# Altium project piggyback.PrjPcb
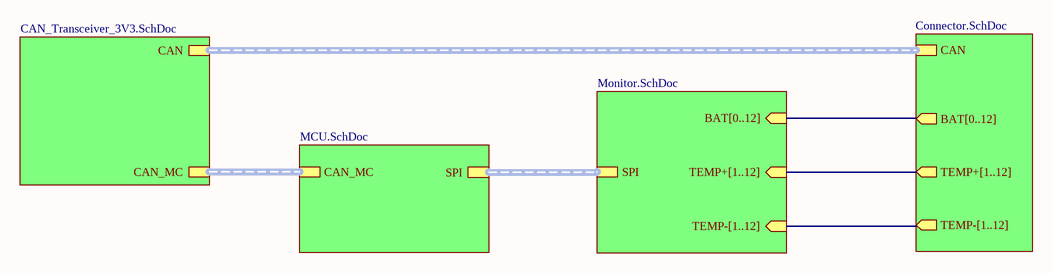
[diagram p0: Main.SchDoc]
11 sheets, 315 parts. Net scope: hierarchical (ports join the sheet entries above them; power ports are global).
Board file: template_4.PcbDoc
Sheets:
  Main.SchDoc
    S2 = MCU.SchDoc
     = CAN_Transceiver_3V3.SchDoc
    S4 = Monitor.SchDoc
      S5 = Input_Fuses.SchDoc
      S6 = LTC_6811-1.SchDoc
      S7 = Mux.SchDoc
      U_passive_balancing = passive_balancing.SchDoc
      U_primary_decoupling = decoupling.SchDoc
      TEMP1 = subtractor_single.SchDoc
      TEMP2 = subtractor_single.SchDoc
      TEMP3 = subtractor_single.SchDoc
      TEMP4 = subtractor_single.SchDoc
      TEMP5 = subtractor_single.SchDoc
      TEMP6 = subtractor_single.SchDoc
      TEMP7 = subtractor_single.SchDoc
      TEMP8 = subtractor_single.SchDoc
      TEMP9 = subtractor_single.SchDoc
      TEMP10 = subtractor_single.SchDoc
      TEMP11 = subtractor_single.SchDoc
      TEMP12 = subtractor_single.SchDoc
    S9 = Connector.SchDoc

## Sheet Main.SchDoc
size 250 x 119 mm; DocumentNumber: 6; SheetNumber: 6; SheetTotal: 11

### Sub-sheets
S2 = MCU.SchDoc: CAN_MC (harness CAN_MC), SPI (harness SPI)
S4 = Monitor.SchDoc: BAT[0..12] (in), TEMP+[1..12] (in), SPI (harness SPI), TEMP-[1..12] (in)
S9 = Connector.SchDoc: BAT[0..12] (out), TEMP+[1..12] (out), CAN (harness CAN), TEMP-[1..12] (out)
? = CAN_Transceiver_3V3.SchDoc: CAN_MC (harness CAN_MC), CAN (harness CAN)

### Buses and harness runs
bus sheet S4/BAT[0..12] = sheet S9/BAT[0..12]
bus sheet S4/TEMP+[1..12] = sheet S9/TEMP+[1..12]
bus sheet S4/TEMP-[1..12] = sheet S9/TEMP-[1..12]
harness sheet /CAN = sheet S9/CAN
harness sheet /CAN_MC = sheet S2/CAN_MC
harness sheet S2/SPI = sheet S4/SPI

## Sheet MCU.SchDoc
size 250 x 149 mm; DocumentNumber: 1; SheetNumber: 1; SheetTotal: 11
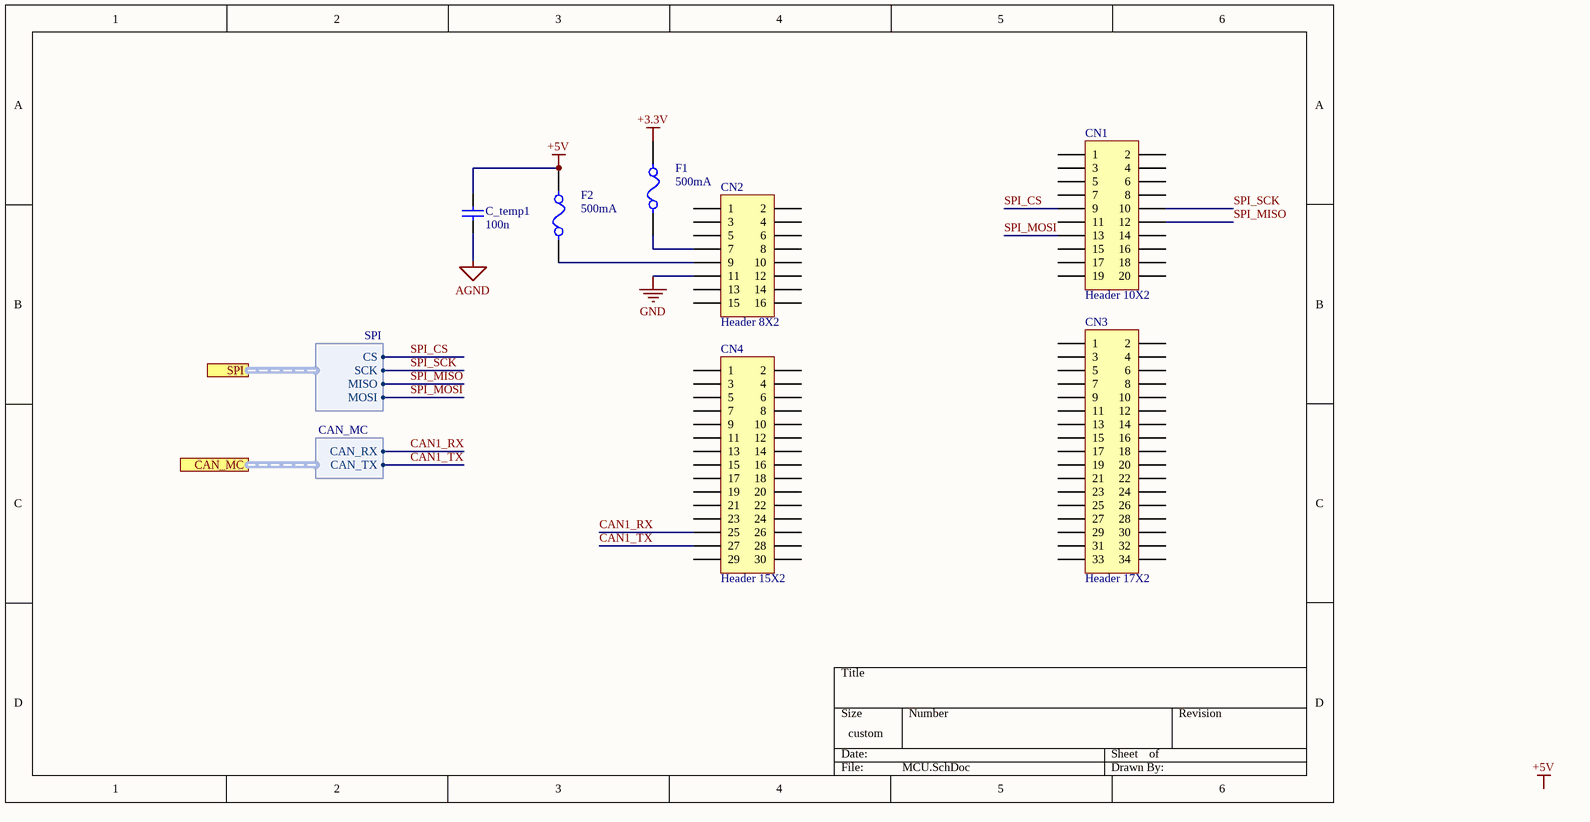
[diagram p1: MCU.SchDoc]

### Parts
C_temp1  100n  [CAPC0603(1608)55_N]
CN1  Header 10X2  [HDR2X10]
CN2  Header 8X2  [HDR2X8]
CN3  Header 17X2  [HDR2X17]
CN4  Header 15X2  [HDR2X15]
F1  500mA  [Fuse_500_mA]
F2  500mA  [Fuse_500_mA]

### Ports
CAN_MC (harness CAN_MC), SPI (harness SPI)

### Harnesses
SPI: CS, SCK, MISO, MOSI
CAN_MC: CAN_RX, CAN_TX

### Nets
+3.3V: F1.2
+5V: C_temp1.1 F2.2
AGND: C_temp1.2
GND: CN2.11
CAN1_RX: CN4.25 ; port CAN_MC.CAN_RX
CAN1_TX: CN4.27 ; port CAN_MC.CAN_TX
SPI_CS: CN1.9 ; port SPI.CS  [project net CS]
SPI_MISO: CN1.12 ; port SPI.MISO  [project net MISO]
SPI_MOSI: CN1.13 ; port SPI.MOSI  [project net MOSI]
SPI_SCK: CN1.10 ; port SPI.SCK  [project net SCK]
NetCN2_7: CN2.7 F1.1
NetCN2_9: CN2.9 F2.1

Not connected (* = marked no-connect by the designer): CN1 1 2 3 4 5 6 7 8 11 14 15 16 17 18 19 20; CN2 1 2 3 4 5 6 8 10 12 13 14 15 16; CN3 1 2 3 4 5 6 7 8 9 10 11 12 13 14 15 16 17 18 19 20 21 22 23 24 25 26 27 28 29 30 31 32 33 34; CN4 1 2 3 4 5 6 7 8 9 10 11 12 13 14 15 16 17 18 19 20 21 22 23 24 26 28 29 30

### Notes on the sheet
- Labels drawn without touching a wire or pin: +5V

### Library data of the parts
C_temp1 = Cap 100n: Keramikvielschichtkondensator, SMD, Baureihe MC, ± 10%; Manufacturer: TDK; Voltage Rating: 50V; OC_MOUSER: CGA3E2X7R1H104K080AA; Value: 100n; PackageReference: 0603; Tolerance: ± 10%
CN1 = Header 10X2: Header, 10-Pin, Dual row; LatestRevisionDate: 17-Jul-2002; LatestRevisionNote: Re-released for DXP Platform.; Publisher: Altium Limited
CN2 = Header 8X2: Header, 8-Pin, Dual row; LatestRevisionDate: 17-Jul-2002; LatestRevisionNote: Re-released for DXP Platform.; Publisher: Altium Limited
CN3 = Header 17X2: Header, 17-Pin, Dual row; LatestRevisionDate: 17-Jul-2002; LatestRevisionNote: Re-released for DXP Platform.; Publisher: Altium Limited
CN4 = Header 15X2: Header, 15-Pin, Dual row; LatestRevisionDate: 17-Jul-2002; LatestRevisionNote: Re-released for DXP Platform.; Publisher: Altium Limited
F1 F2 = Fuse_500mA: 0679H0500-01, Sicherungen zur Aufbaumontage 500mA 350 VAC 72 VCD; Voltage_Rating: 72 VDC; Value: 500mA; OC_Mouser: 530-0679H0500-01

## Sheet CAN_Transceiver_3V3.SchDoc
size A4; DocumentNumber: 2; SheetNumber: 2; SheetTotal: 11
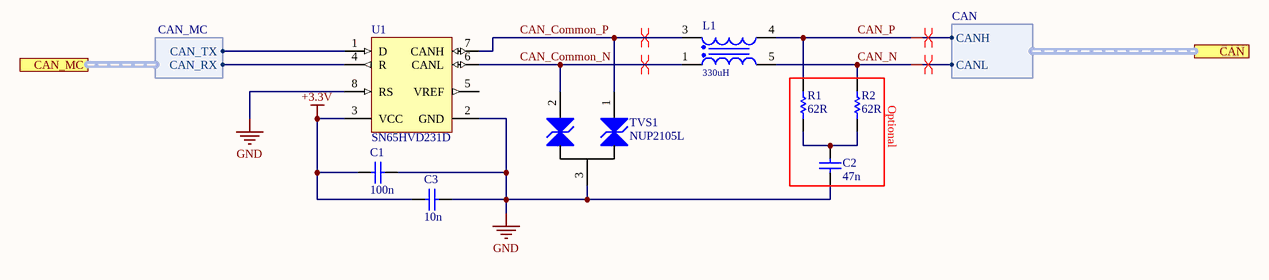
[diagram p2: CAN_Transceiver_3V3.SchDoc]

### Parts
C1  100n  [CAPC0603(1608)55_N]
C2  47n  [CAPC0603(1608)55_N]
C3  10n  [CAPC0603(1608)55_N]
L1  330uH  [WE-SL1]
R1  62R  [RESC0603(1608)_N]
R2  62R  [RESC0603(1608)_N]
TVS1  NUP2105L  [_SOT23-3N]
U1  SN65HVD231D  [D0008A_L]

### Ports
CAN (harness CAN), CAN_MC (harness CAN_MC)

### Harnesses
CAN_MC: CAN_RX, CAN_TX
CAN: CANH, CANL

### Nets
+3.3V: C1.1 C3.1 U1.3(VCC)
GND: C1.2 C2.1 C3.2 TVS1.3(A3) U1.2(GND) U1.8(RS)
CAN1_RX: U1.4(R) ; port CAN_MC.CAN_RX
CAN1_TX: U1.1(D) ; port CAN_MC.CAN_TX
CAN_Common_N: L1.1 TVS1.2(A2) U1.6(CANL)
CAN_Common_P: L1.3 TVS1.1(A1) U1.7(CANH)
CAN_N: L1.5 R2.2 ; port CAN.CANL
CAN_P: L1.4 R1.2 ; port CAN.CANH
NetC2_2: C2.2 R1.1 R2.1

Not connected (* = marked no-connect by the designer): U1 5(VREF)

### Layout directives
differential pair: CAN_Common_N, CAN_Common_P, CAN_N, CAN_P

### Notes on the sheet
- (near R2) Optional

### Library data of the parts
C1 = Cap 100n: as C_temp1 on sheet MCU; OC_MOUSER: CGA3E2X7R1H104K080AA; Value: 100n; PackageReference: 0603; Tolerance: ± 10%
C2 = Cap 47n: Keramikvielschichtkondensator, SMD, Baureihe MC, ± 10%; Manufacturer: TDK; Voltage Rating: 50V; OC_MOUSER: CGA3E2X7R1H473K080AA; Value: 47n; PackageReference: 0603; Tolerance: ± 10%
C3 = Cap 10n: Keramikvielschichtkondensator, SMD, Baureihe MC, ± 10%; Manufacturer: TDK; Voltage Rating: 50V; OC_MOUSER: CGA3E2X7R1H103K080AA; Value: 10n; PackageReference: 0603; Tolerance: ± 10%
L1 = 744212331: WE-SL1 SMT Common Mode Line Filter, 330uH, 300mA, 80V; Manufacturer: Wurth Elektronik; Impedance max.: 2000Ohm; Insulation Test Voltage: 250VAC; Winding Style: sectional; ComponentLink1Description: Manufacturer; ComponentLink1URL: http://www.we-online.de; ComponentLink2Description: Datasheet; ComponentLink2URL: https://www.we-online.com/catalog/datasheet/744212331.pdf; Published Date: April 2020; Rated Current: 300mA; Rated Voltage: 80V; Inductance: 330uH; Operating Temperature: -40 to +105degC; Mounting Technology: SMT; Packaging: Tape and Reel; Manufacturer Part Number: 744212331
R1 R2 = Res 62R: Chipwiderstand, SMD, Baureihe MC, 1%; Manufacturer: Multicomp; Power: 100mW; PackageReference: 0603; Value: 62R; OC_FARNELL: 9331433
TVS1 = NUP2105L: Dual Bidirectional Voltage Suppressor 350W Peak
U1 = CMP-0315-00079-2: 3.3V CAN Transceiver with Sleep Mode, 17 mA, 3.3 V, -40 to 85 degC, 8-pin SOIC (D), Green (RoHS & no Sb/Br); Manufacturer: Texas Instruments; Drivers Per Package: 1; Rating: Catalog; Transient Pulse Protection(V): -25 to 25; Supply Voltage(s)(V): 3.3; ICC(Max)(mA): 17; Features: Bus Wake Up; Footprint: PCA82C250; ComponentLink1URL: http://www.ti.com/general/docs/lit/getliterature.tsp?genericPartNumber=SN65HVD231&fileType=pdf; PackageVersion: revM, Jun-2011; SubFamily: CAN; PartNumber: SN65HVD231D; DatasheetVersion: SLOS346K; Isolated: No; PackageDescription: 8-Pin Plastic Small Outline Integrated Circuit, 4.9 x 3.9 mm, Pitch 1.27 mm Pitch; Low Power Mode: Sleep; Code_JEDEC: MS-012AA; ComponentLink1Description: Datasheet; PackageReference: D0008A; Eco-Plan: Green (RoHS & no Sb/Br); Mounting Technology: Surface Mount; Receivers Per Package: 1

## Sheet Monitor.SchDoc
size 299 x 149 mm; DocumentNumber: 8; SheetNumber: 8; SheetTotal: 11
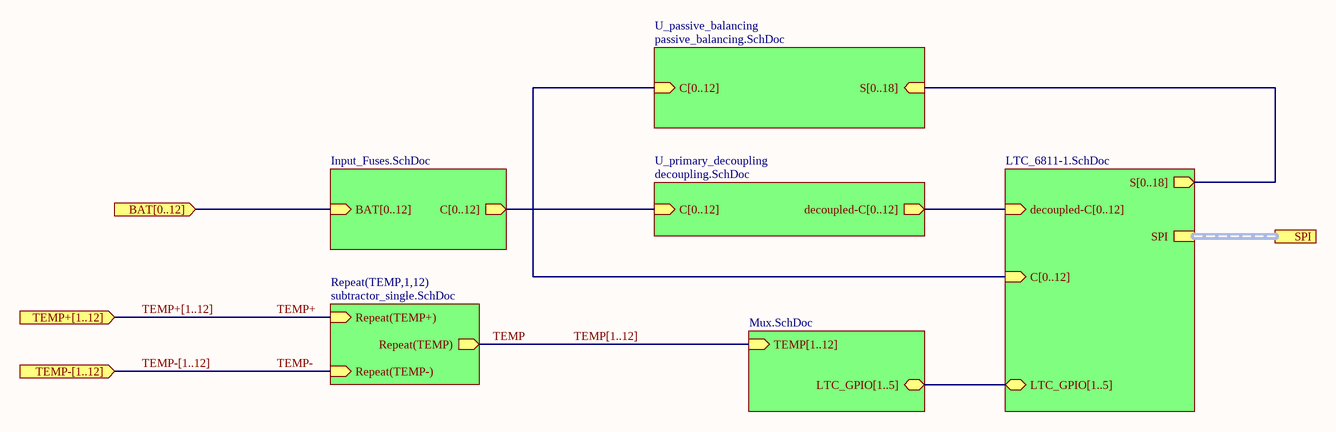
[diagram p3: Monitor.SchDoc]

### Sub-sheets
Repeat(TEMP,1,12) = subtractor_single.SchDoc: Repeat(TEMP+) (in), Repeat(TEMP) (out), Repeat(TEMP-) (in)
S5 = Input_Fuses.SchDoc: BAT[0..12] (in), C[0..12] (out)
S6 = LTC_6811-1.SchDoc: LTC_GPIO[1..5] (bidir), SPI (harness SPI), S[0..18] (out), decoupled-C[0..12] (in), C[0..12] (in)
S7 = Mux.SchDoc: TEMP[1..12] (in), LTC_GPIO[1..5] (bidir)
U_passive_balancing = passive_balancing.SchDoc: S[0..18] (in), C[0..12] (in)
U_primary_decoupling = decoupling.SchDoc: C[0..12] (in), decoupled-C[0..12] (out)

### Ports
BAT[0..12] (in), SPI (harness SPI), TEMP+[1..12] (in), TEMP-[1..12] (in)

### Nets
TEMP: sheet Repeat(TEMP,1,12)/Repeat(TEMP)
TEMP+: sheet Repeat(TEMP,1,12)/Repeat(TEMP+)
TEMP-: sheet Repeat(TEMP,1,12)/Repeat(TEMP-)

### Buses and harness runs
bus port BAT[0..12] = sheet S5/BAT[0..12]
bus sheet S5/C[0..12] = sheet S6/C[0..12] = sheet U_passive_balancing/C[0..12] = sheet U_primary_decoupling/C[0..12]
bus sheet S6/decoupled-C[0..12] = sheet U_primary_decoupling/decoupled-C[0..12]
bus sheet S6/LTC_GPIO[1..5] = sheet S7/LTC_GPIO[1..5]
bus sheet S6/S[0..18] = sheet U_passive_balancing/S[0..18]
bus TEMP+[1..12] = port TEMP+[1..12]
bus TEMP-[1..12] = port TEMP-[1..12]
bus TEMP[1..12] = sheet S7/TEMP[1..12]
harness port SPI = sheet S6/SPI

## Sheet Input_Fuses.SchDoc
size 199 x 250 mm; DocumentNumber: 4; SheetNumber: 4; SheetTotal: 11
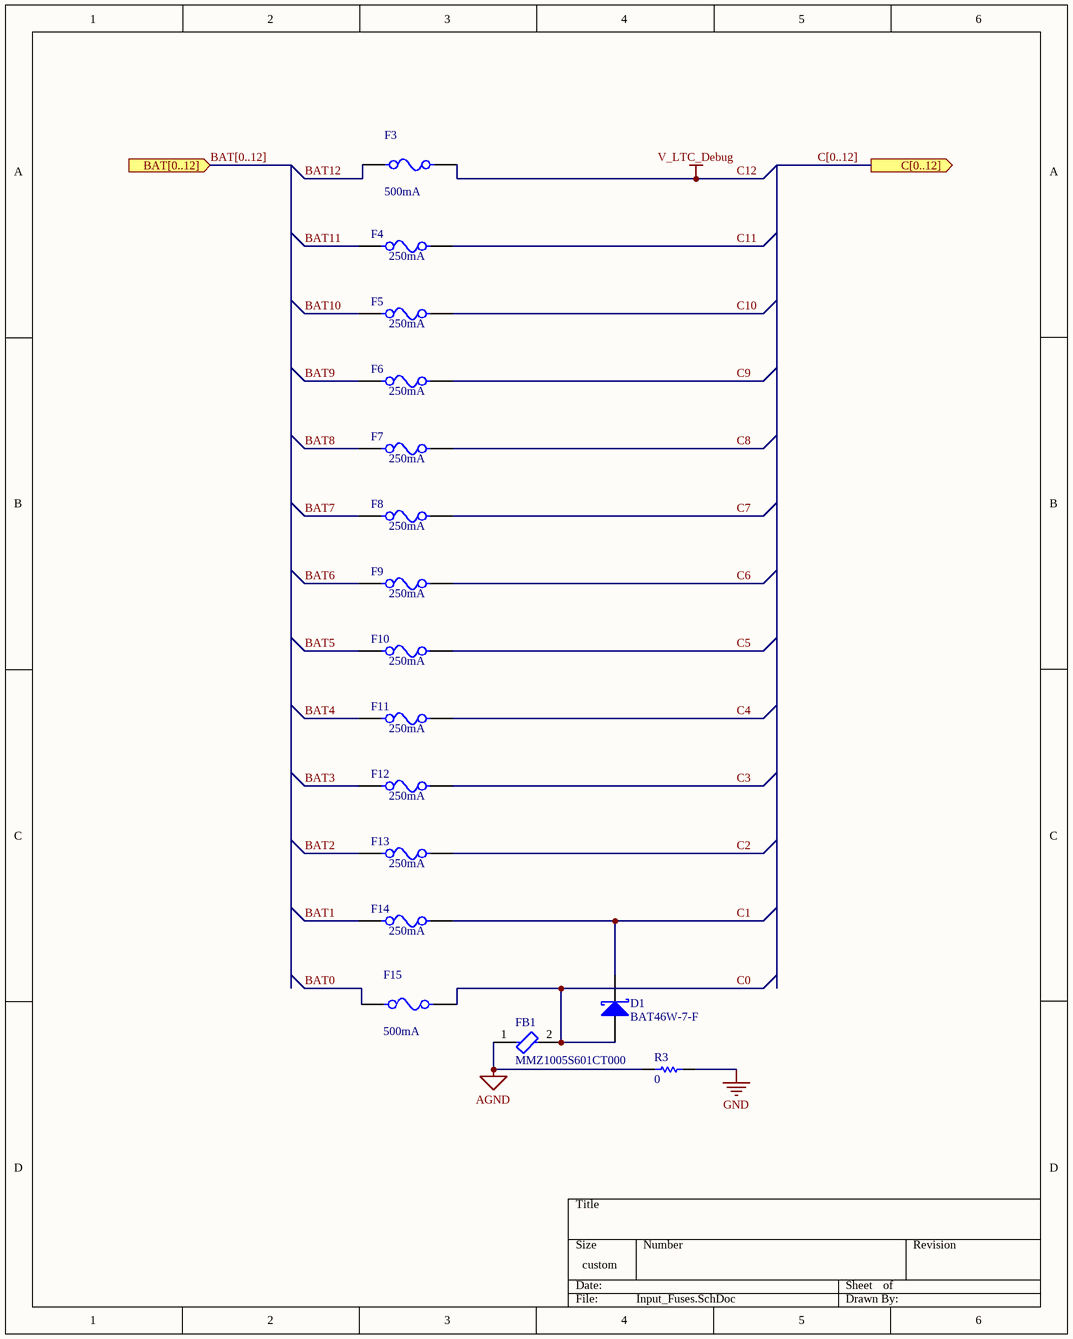
[diagram p4: Input_Fuses.SchDoc]

### Parts
D1  BAT46W-7-F  [DIOD-SOD-123-2_V]
F3  500mA  [Fuse_500_mA]
F4  250mA  [RESC0603(1608)_N]
F5  250mA  [RESC0603(1608)_N]
F6  250mA  [RESC0603(1608)_N]
F7  250mA  [RESC0603(1608)_N]
F8  250mA  [RESC0603(1608)_N]
F9  250mA  [RESC0603(1608)_N]
F10  250mA  [RESC0603(1608)_N]
F11  250mA  [RESC0603(1608)_N]
F12  250mA  [RESC0603(1608)_N]
F13  250mA  [RESC0603(1608)_N]
F14  250mA  [RESC0603(1608)_N]
F15  500mA  [Fuse_500_mA]
FB1  MMZ1005S601CT000  [FP-MMZ1005-MFG]
R3  0  [RESC0603(1608)_N]

### Ports
BAT[0..12] (in), C[0..12] (out)

### Nets
AGND: FB1.1 R3.2
C12: F3.1  [also labelled V_LTC_Debug]
GND: R3.1
BAT0: F15.2
BAT1: F14.1
BAT2: F13.1
BAT3: F12.1
BAT4: F11.1
BAT5: F10.1
BAT6: F9.1
BAT7: F8.1
BAT8: F7.1
BAT9: F6.1
BAT10: F5.1
BAT11: F4.1
BAT12: F3.2
C0: D1.1(A) F15.1 FB1.2
C1: D1.2(K) F14.2
C2: F13.2
C3: F12.2
C4: F11.2
C5: F10.2
C6: F9.2
C7: F8.2
C8: F7.2
C9: F6.2
C10: F5.2
C11: F4.2

### Buses and harness runs
bus BAT[0..12] = port BAT[0..12]
bus C[0..12] = port C[0..12]

### Library data of the parts
D1 = CMP-0303-00004-1: Surface Mount Schottky Barrier Diode, 100 V, -55 to 125 degC, 2-Pin SOD123, RoHS, Tape and Reel; Manufacturer: Diodes Inc; IR@1.5 V: 0.3 uA Max.; V(BR)R: 100 V Min.; VF@10 mA: 0.45 V Max.; CT@1 V: 12 pF Typ.; PartNumber: BAT46W-7-F; ComponentLink1URL: http://www.diodes.com/; ComponentLink3URL: http://diodes.com/datasheets/ds30044.pdf; PackageDescription: 2-Pin SMD, Body 2.7 x 1.55 mm, Height 1.45 mm; ComponentLink2Description: Datasheet; ComponentLink3Description: Package Specification; Mounting Technology: Surface Mount; ComponentLink1Description: Manufacturer URL; RoHS: TRUE; Operating Temperature: -55 to 125 degC; Packing: Tape and Reel; ComponentLink2URL: http://diodes.com/datasheets/ds30044.pdf; DatasheetVersion: Rev. 16-2
F3 F15 = Fuse_500mA: as F1 on sheet MCU; Value: 500mA; OC_Mouser: 530-0679H0500-01
F4-F14 = Bel Fuse C2Q250: Fuse, Fast Blow 250mA, 63VDC; Voltage Rating AC: 32V; Voltage Rating DC: 63; OC_Mouser: 530-C2Q250; Value: 250mA; PackageReference: 0603; Manufacturer: Bel Fuse; Characteristic: Fast Blow
FB1 = CMP-08257-000098-1: Signal Line Ferrite Bead 600Ω @ 100MHz 300mA DCR 520mΩ SMD 0402; Tolerance: 25%; Impedance: 600R; DC Resistance (DCR): 600mR; Height: 0.022inch; Series: MMZ; Case Code (Metric): 1005; Case Code (Imperial): 0402; Length: 0.039inch; RoHS Compliant: Yes; Package Quantity: 10000; Case/Package: 0402; Packaging: Cut Tape; Current Rating: 300mA; Max DC Current: 300mA; Width: 0.02inch; Core Material: Ferrite; Lead Free: Lead Free; REACH SVHC: No SVHC; Mount: Surface Mount
R3 = Res 0R: Chipwiderstand, SMD, Baureihe MC, 1%; Manufacturer: Multicomp; Value: 0R; Power: 100mW; PackageReference: 0603; OC_FARNELL: 9331662

## Sheet LTC_6811-1.SchDoc
size 299 x 299 mm; DocumentNumber: 5; SheetNumber: 5; SheetTotal: 11
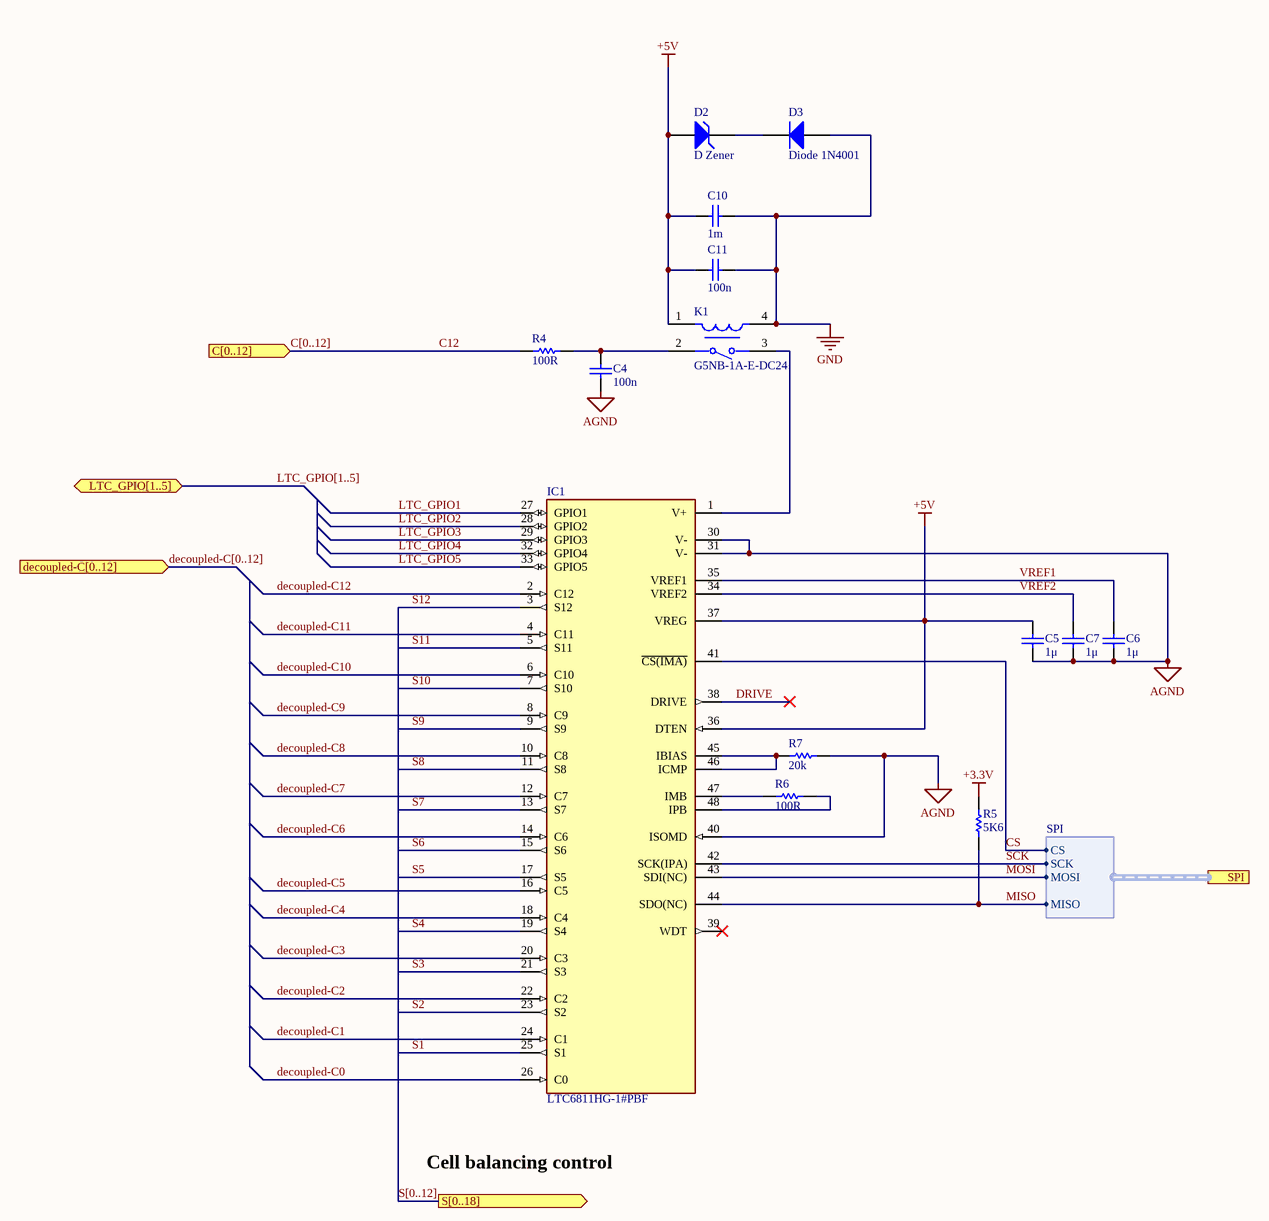
[diagram p5: LTC_6811-1.SchDoc]

### Parts
C4  100n  [CAPC0603(1608)55_N]
C5  1μ  [CAPC0603(1608)55_N]
C6  1μ  [CAPC0603(1608)55_N]
C7  1μ  [CAPC0603(1608)55_N]
C10  1m  [CAPC0603(1608)55_N]
C11  100n  [CAPC0603(1608)55_N]
D2  D Zener  [DIODE-0.7]
D3  Diode 1N4001  [DO-41]
IC1  LTC6811HG-1#PBF  [FP-G-48-05-08-1887-MFG]
K1  G5NB-1A-E-DC24  [FP-G5NB-1A-E-DC24-MFG]
R4  100R  [RESC0603(1608)_N]
R5  5K6  [RESC0603(1608)_N]
R6  100R  [RESC0603(1608)_N]
R7  20k  [RESC0603(1608)_N]

### Ports
C[0..12] (in), decoupled-C[0..12] (in), LTC_GPIO[1..5] (bidir), S[0..18] (out), SPI (harness SPI)

### Harnesses
SPI: SCK, MOSI, MISO, CS

### Nets
+3.3V: R5.2
+5V: C5.2 C10.1 C11.1 D2.1(A) IC1.36(DTEN) IC1.37(VREG) K1.1
AGND: C4.1 C5.1 C6.1 C7.1 IC1.30(V-) IC1.31(V-) IC1.40(ISOMD) R7.2
C12: R4.1
GND: C10.2 C11.2 D3.1(A) K1.4
CS: IC1.41(~{CS(IMA)}) ; port SPI.CS
decoupled-C0: IC1.26(C0)
decoupled-C1: IC1.24(C1)
decoupled-C2: IC1.22(C2)
decoupled-C3: IC1.20(C3)
decoupled-C4: IC1.18(C4)
decoupled-C5: IC1.16(C5)
decoupled-C6: IC1.14(C6)
decoupled-C7: IC1.12(C7)
decoupled-C8: IC1.10(C8)
decoupled-C9: IC1.8(C9)
decoupled-C10: IC1.6(C10)
decoupled-C11: IC1.4(C11)
decoupled-C12: IC1.2(C12)
DRIVE: IC1.38(DRIVE)
LTC_GPIO1: IC1.27(GPIO1)
LTC_GPIO2: IC1.28(GPIO2)
LTC_GPIO3: IC1.29(GPIO3)
LTC_GPIO4: IC1.32(GPIO4)
LTC_GPIO5: IC1.33(GPIO5)
MISO: IC1.44(SDO(NC)) R5.1 ; port SPI.MISO
MOSI: IC1.43(SDI(NC)) ; port SPI.MOSI
S1: IC1.25(S1)
S2: IC1.23(S2)
S3: IC1.21(S3)
S4: IC1.19(S4)
S5: IC1.17(S5)
S6: IC1.15(S6)
S7: IC1.13(S7)
S8: IC1.11(S8)
S9: IC1.9(S9)
S10: IC1.7(S10)
S11: IC1.5(S11)
S12: IC1.3(S12)
SCK: IC1.42(SCK(IPA)) ; port SPI.SCK
VREF1: C6.2 IC1.35(VREF1)
VREF2: C7.2 IC1.34(VREF2)
NetC4_2: C4.2 K1.2 R4.2
NetD2_2: D2.2(K) D3.2(K)
NetIC1_1: IC1.1(V+) K1.3
NetIC1_45: IC1.45(IBIAS) IC1.46(ICMP) R7.1
NetIC1_47: IC1.47(IMB) R6.1
NetIC1_48: IC1.48(IPB) R6.2

Not connected (* = marked no-connect by the designer): IC1 39(WDT)*

### Buses and harness runs
bus C[0..12] = port C[0..12]
bus decoupled-C[0..12] = port decoupled-C[0..12]
bus LTC_GPIO[1..5] = port LTC_GPIO[1..5]
bus S[0..12] = port S[0..18]

### Notes on the sheet
- Cell balancing control

### Library data of the parts
C4 C11 = Cap 100n: as C_temp1 on sheet MCU; OC_MOUSER: CGA3E2X7R1H104K080AA; Value: 100n; PackageReference: 0603; Tolerance: ± 10%
C5-C7 = Cap 1μ: Keramikvielschichtkondensator, SMD, Baureihe MC, ± 10%; Manufacturer: TDK; Voltage Rating: 50V; OC_MOUSER: CGA3E3X5R1H105K080AB; Value: 1μ; PackageReference: 0603; Tolerance: ± 10%
C10 = Cap - template 0603: Keramikvielschichtkondensator, SMD, Baureihe MC, ± 10%; Manufacturer: eintragen !!!; Value: eintragen !!!; Tolerance: ± eintragen !!!; OC_MOUSER: eintragen !!!; PackageReference: 0603; Voltage Rating: eintragen !!!
D2 = D Zener: Zener Diode; Published: 8-Jun-2000; LatestRevisionDate: 17-Jul-2002; LatestRevisionNote: Re-released for DXP Platform.; PackageReference: DIODE-0.7; Publisher: Altium Limited; PackageDescription: Diode, Thru-Hole; 2 Leads; 0.7 in Pin Spacing
D3 = Diode 1N4001: 1 Amp General Purpose Rectifier; Published: 8-Jun-2000; LatestRevisionDate: 17-Jul-2002; LatestRevisionNote: Re-released for DXP Platform.; DatasheetVersion: 1998; PackageVersion: Aug-1999; PackageReference: DO-41; Publisher: Altium Limited; PackageDescription: Diode, Axial; Body 5.2 x 2.7 mm (LxDia. max), Lead Dia. 0.86 mm (max); Code_JEDEC: DO-204-AL; ComponentLink1Description: Manufacturer Link; ComponentLink1URL: http://www.fairchildsemi.com/; ComponentLink2Description: Datasheet; ComponentLink2URL: http://www.fairchildsemi.com/ds/1N%2F1N4001.pdf
IC1 = CMP-09132-000004-1: IC MONITOR BATT STACK 48SSOP; Manufacturer: Analog Devices; Max Supply Voltage: 55V; Min Supply Voltage: 4.5V; Standoff Height: 0.05mm; Number Of Cells: 12; Max Junction Temp: +150°C; Lead Free: Yes; Octopart: https://octopart.com/ltc6811hg-1%23pbf-analog+devices-88968888; Automotive: No; ComponentLink2URL: https://www.analog.com/media/en/technical-documentation/data-sheets/68111fb.pdf; Temperature Range High: +125°C; RoHS: TRUE; Device Class L3: Battery Management; Height: 2mm; Device Class L1: Integrated Circuits (ICs); ComponentLink2Description: Datasheet; Digikey Description: IC MONITOR BATT STACK 48SSOP; Device Class L2: Power Management ICs; Mouser Description: Sc-Automotive Multicell Battery Stack Monitor With Addressable Isospi Interface; Temperature Range Low: -40°C; Category: IC; Temperature: -40°C to +125°C; Package: G-48-05-08-1887; Manufacturer Part Number: LTC6811HG-1#PBF
K1 = CMP-08822-000175-1: RELAY GEN PURPOSE SPST 5A 24V; Release Time: 10ms; Max Voltage Rating (AC): 250V; Coil Resistance: 2.88kR; Coil Power: 200mW; Coil Type: Non-Latching; Coil Current: 8.3mA; Max Voltage Rating (DC): 30V; Relay Type: General Purpose; Radiation Hardening: No; Operate Time: 10ms; Packaging: Bulk; Number of Pins: 4; Weight: 4g; Throw Configuration: SPST; Contact Current Rating: 5A; Mount: Through Hole; Coil Voltage (DC): 24V; Termination: PC Pin; Max Operating Temperature: 70°C; Min Operating Temperature: -40°C; Series: G5NB-E; Package Quantity: 100
R4 R6 = Res 100R: Chipwiderstand, SMD, Baureihe MC, 1%; Manufacturer: Multicomp; Power: 100mW; PackageReference: 0603; Value: 100R; OC_FARNELL: 2447227
R5 = Res 5K6: Chipwiderstand, SMD, Baureihe MC, 1%; Manufacturer: Multicomp; Power: 100mW; PackageReference: 0603; Value: 5K6; OC_FARNELL: 9332219
R7 = Res - template 0603: Chipwiderstand, SMD, Baureihe MC, 1%; Manufacturer: Multicomp; Power: 100mW; PackageReference: 0603; Value: 20k; OC_FARNELL: eintragen!!!!

## Sheet Mux.SchDoc
size 250 x 199 mm; DocumentNumber: 9; SheetNumber: 9; SheetTotal: 11
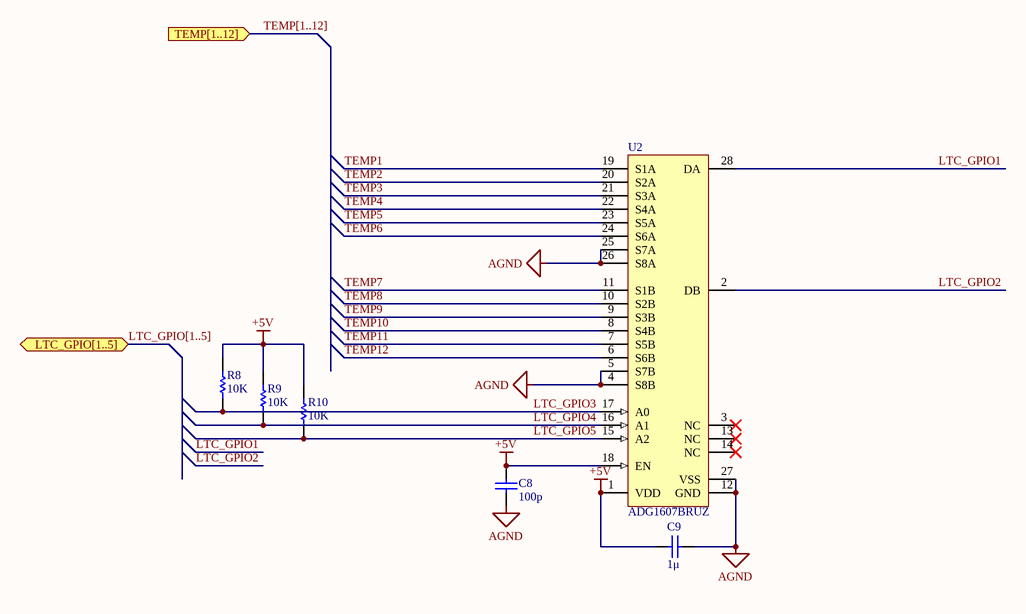
[diagram p6: Mux.SchDoc]

### Parts
C8  100p  [CAPC0603(1608)55_N]
C9  1μ  [CAPC0603(1608)55_N]
R8  10K  [RESC0603(1608)_N]
R9  10K  [RESC0603(1608)_N]
R10  10K  [RESC0603(1608)_N]
U2  ADG1607BRUZ  [ADI-RU-28_M]

### Ports
LTC_GPIO[1..5] (bidir), TEMP[1..12] (in)

### Nets
+5V: C8.2 C9.1 R8.2 R9.2 R10.2 U2.1(VDD) U2.18(EN)
AGND: C8.1 C9.2 U2.4(S8B) U2.5(S7B) U2.12(GND) U2.25(S7A) U2.26(S8A) U2.27(VSS)
LTC_GPIO1: U2.28(DA)
LTC_GPIO2: U2.2(DB)
LTC_GPIO3: R8.1 U2.17(A0)
LTC_GPIO4: R9.1 U2.16(A1)
LTC_GPIO5: R10.1 U2.15(A2)
TEMP1: U2.19(S1A)
TEMP2: U2.20(S2A)
TEMP3: U2.21(S3A)
TEMP4: U2.22(S4A)
TEMP5: U2.23(S5A)
TEMP6: U2.24(S6A)
TEMP7: U2.11(S1B)
TEMP8: U2.10(S2B)
TEMP9: U2.9(S3B)
TEMP10: U2.8(S4B)
TEMP11: U2.7(S5B)
TEMP12: U2.6(S6B)

Not connected (* = marked no-connect by the designer): U2 3(NC)* 13(NC)* 14(NC)*

### Buses and harness runs
bus LTC_GPIO[1..5] = port LTC_GPIO[1..5]
bus TEMP[1..12] = port TEMP[1..12]

### Library data of the parts
C8 = Cap 100p: Keramikvielschichtkondensator, SMD, Baureihe MC, ± 5%; Manufacturer: TDK; Voltage Rating: 50V; OC_MOUSER: CGA3E2C0G1H101J080AE; Value: 100p; PackageReference: 0603; Tolerance: ± 5%
C9 = Cap 1μ: as C5 on sheet LTC_6811-1; OC_MOUSER: CGA3E3X5R1H105K080AB; Value: 1μ; PackageReference: 0603; Tolerance: ± 10%
R8-R10 = Res 10K: Chipwiderstand, SMD, Baureihe MC, 1%; Manufacturer: Multicomp; Power: 100mW; PackageReference: 0603; Value: 10K; OC_FARNELL: 9330399
U2 = CMP-0793-00167-1: 4.5 Ohm Ron, Differential 8-Channel, +/-5 V, +12 V, +5 V, and +3.3 V Multiplexer, 28-pin SOP (RU-28), Tube; Manufacturer: Analog Devices; Bandwidth (Hz): 37M, 38M, 34M, 31M; Ron (ohms): 4; t transition (s): 143n; Max Analog Signal Range: Vss to Vdd; PackageDescription: 28-Pin Thin Shrink Small Outline Package, Body 9.7 x 4.4 mm, Pitch 0.65 mm; ComponentLink1URL: http://www.analog.com/en/index.html; ComponentLink2Description: Datasheet; ComponentLink3URL: http://www.analog.com/static/imported-files/packages/249854663RU_28.pdf; PackageVersion: Mar-05; Mounting Technology: Surface Mount; PartNumber: ADG1607BRUZ; Packing: Tube; ComponentLink1Description: Manufacturer URL; ComponentLink3Description: Package Specification; DatasheetVersion: Rev. 0; ComponentLink2URL: http://www.analog.com/static/imported-files/data_sheets/ADG1606_1607.pdf; Code_JEDEC: MO-153-AE; PackageReference: RU-28

## Sheet passive_balancing.SchDoc: foxBMS BMS-Slave 12-Cell
size 350 x 299 mm; DocumentNumber: 9; SheetNumber: 9; SheetTotal: 21; AUTHOR: Fraunhofer IISB foxBMS Team; SheetDescription: Passive Cell Balancing
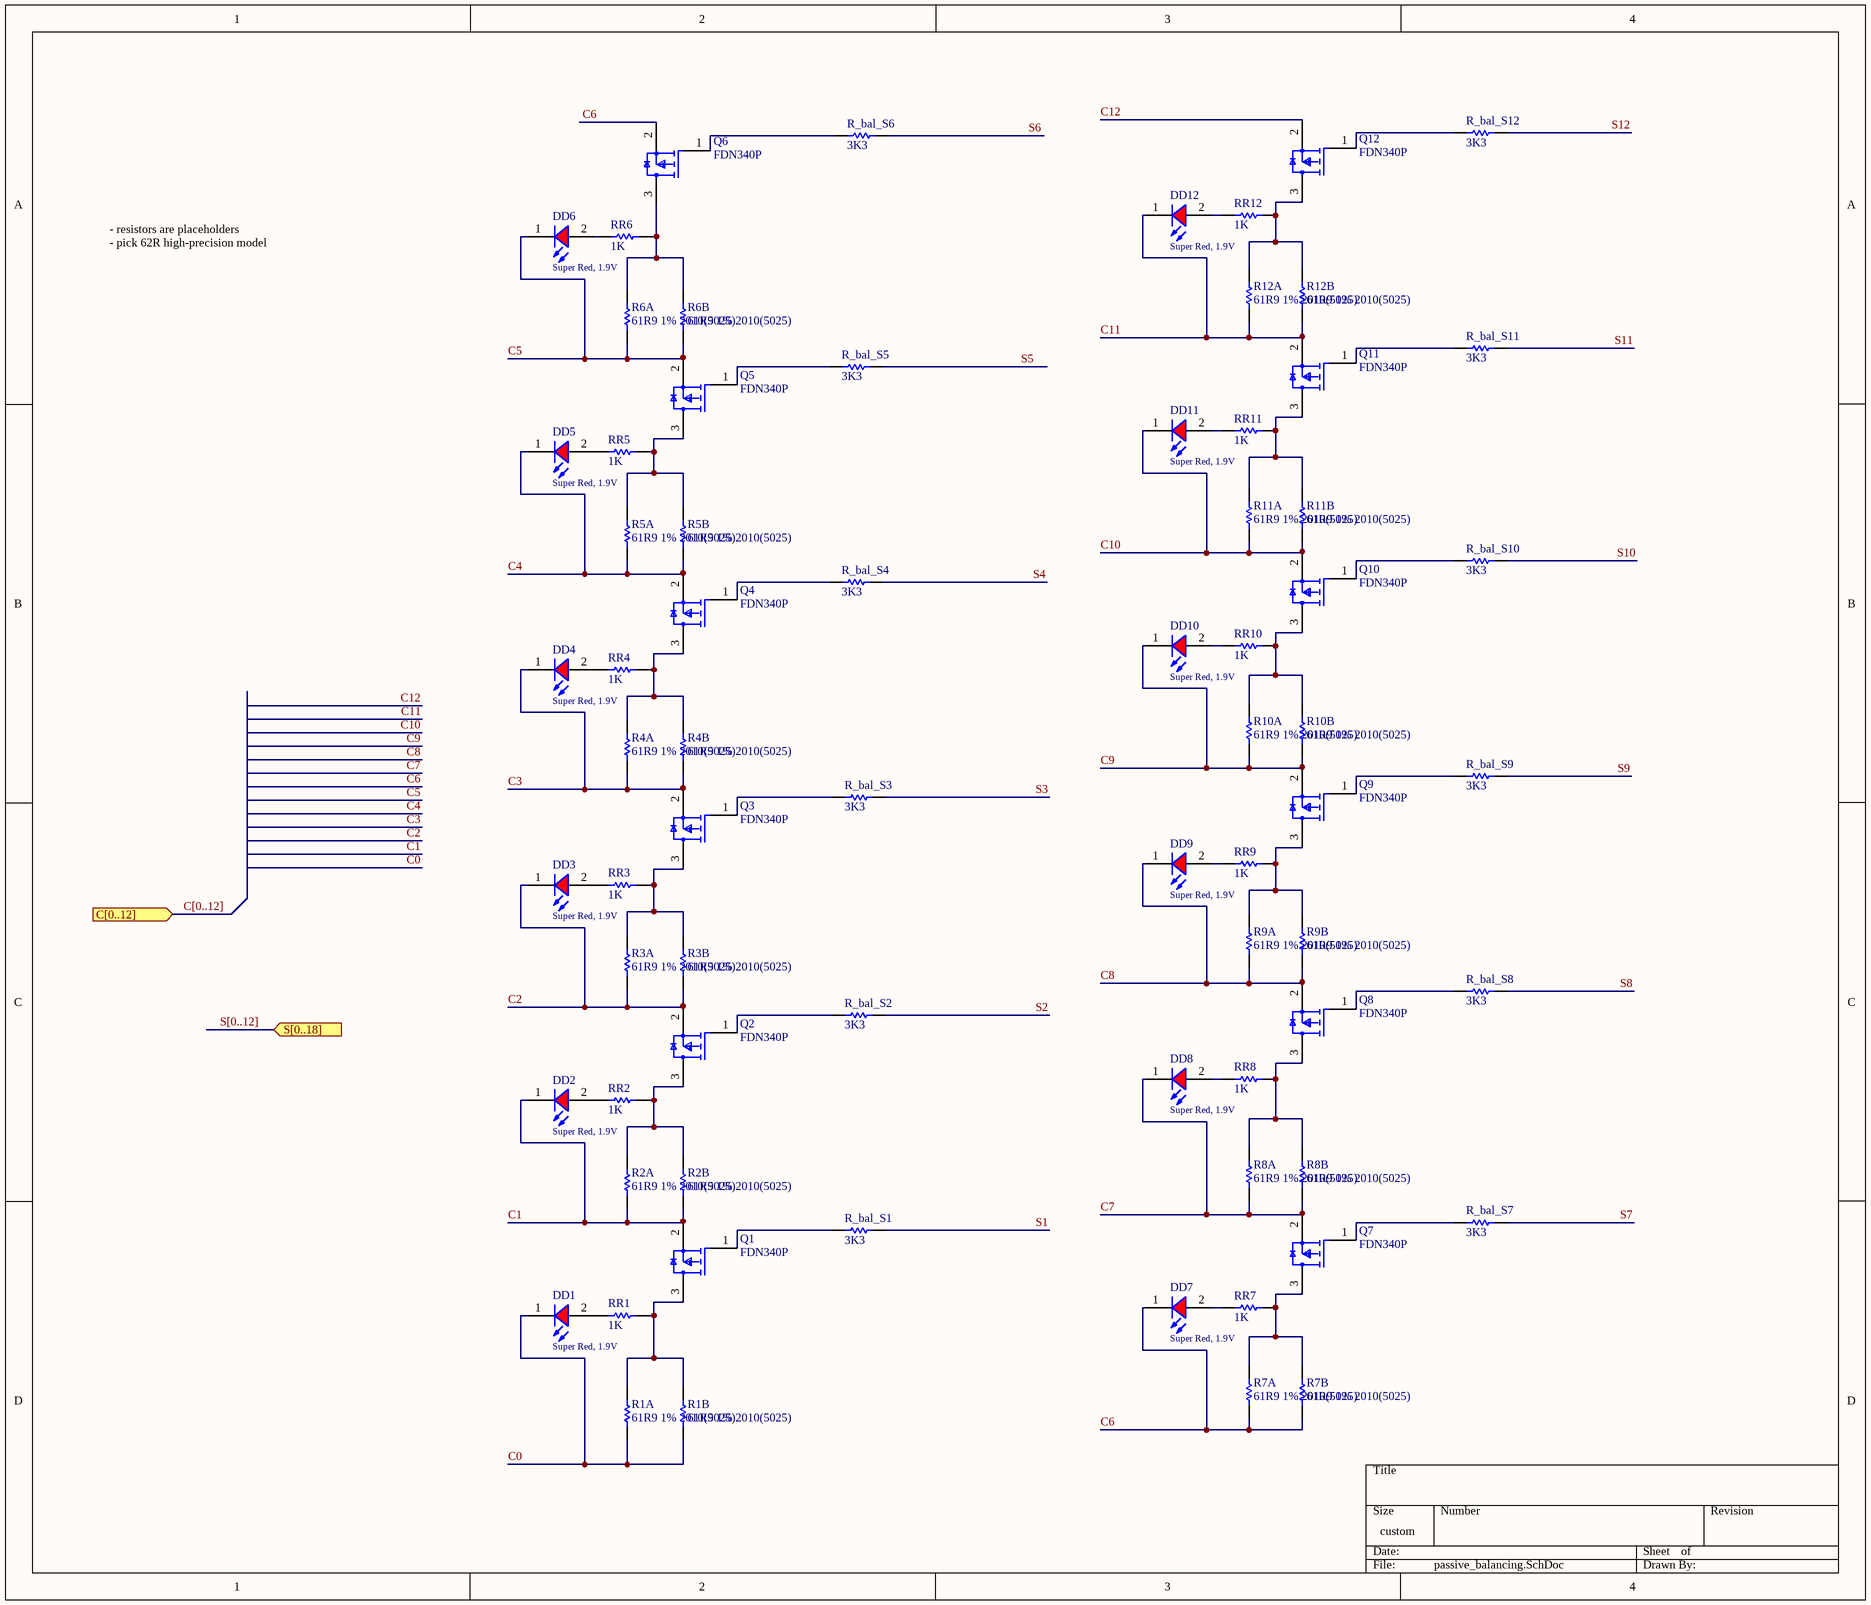
[diagram p7: passive_balancing.SchDoc]

### Parts
DD1  Super Red, 1.9V  [WL-SMCW_0603_H=0.7mm]
DD2  Super Red, 1.9V  [WL-SMCW_0603_H=0.7mm]
DD3  Super Red, 1.9V  [WL-SMCW_0603_H=0.7mm]
DD4  Super Red, 1.9V  [WL-SMCW_0603_H=0.7mm]
DD5  Super Red, 1.9V  [WL-SMCW_0603_H=0.7mm]
DD6  Super Red, 1.9V  [WL-SMCW_0603_H=0.7mm]
DD7  Super Red, 1.9V  [WL-SMCW_0603_H=0.7mm]
DD8  Super Red, 1.9V  [WL-SMCW_0603_H=0.7mm]
DD9  Super Red, 1.9V  [WL-SMCW_0603_H=0.7mm]
DD10  Super Red, 1.9V  [WL-SMCW_0603_H=0.7mm]
DD11  Super Red, 1.9V  [WL-SMCW_0603_H=0.7mm]
DD12  Super Red, 1.9V  [WL-SMCW_0603_H=0.7mm]
Q1  FDN340P  [FP-527AG-MFG]
Q2  FDN340P  [FP-527AG-MFG]
Q3  FDN340P  [FP-527AG-MFG]
Q4  FDN340P  [FP-527AG-MFG]
Q5  FDN340P  [FP-527AG-MFG]
Q6  FDN340P  [FP-527AG-MFG]
Q7  FDN340P  [FP-527AG-MFG]
Q8  FDN340P  [FP-527AG-MFG]
Q9  FDN340P  [FP-527AG-MFG]
Q10  FDN340P  [FP-527AG-MFG]
Q11  FDN340P  [FP-527AG-MFG]
Q12  FDN340P  [FP-527AG-MFG]
R1A  61R9 1% 2010(5025)  [RESC2010(5025)_M]
R1B  61R9 1% 2010(5025)  [RESC2010(5025)_M]
R2A  61R9 1% 2010(5025)  [RESC2010(5025)_M]
R2B  61R9 1% 2010(5025)  [RESC2010(5025)_M]
R3A  61R9 1% 2010(5025)  [RESC2010(5025)_M]
R3B  61R9 1% 2010(5025)  [RESC2010(5025)_M]
R4A  61R9 1% 2010(5025)  [RESC2010(5025)_M]
R4B  61R9 1% 2010(5025)  [RESC2010(5025)_M]
R5A  61R9 1% 2010(5025)  [RESC2010(5025)_M]
R5B  61R9 1% 2010(5025)  [RESC2010(5025)_M]
R6A  61R9 1% 2010(5025)  [RESC2010(5025)_M]
R6B  61R9 1% 2010(5025)  [RESC2010(5025)_M]
R7A  61R9 1% 2010(5025)  [RESC2010(5025)_M]
R7B  61R9 1% 2010(5025)  [RESC2010(5025)_M]
R8A  61R9 1% 2010(5025)  [RESC2010(5025)_M]
R8B  61R9 1% 2010(5025)  [RESC2010(5025)_M]
R9A  61R9 1% 2010(5025)  [RESC2010(5025)_M]
R9B  61R9 1% 2010(5025)  [RESC2010(5025)_M]
R10A  61R9 1% 2010(5025)  [RESC2010(5025)_M]
R10B  61R9 1% 2010(5025)  [RESC2010(5025)_M]
R11A  61R9 1% 2010(5025)  [RESC2010(5025)_M]
R11B  61R9 1% 2010(5025)  [RESC2010(5025)_M]
R12A  61R9 1% 2010(5025)  [RESC2010(5025)_M]
R12B  61R9 1% 2010(5025)  [RESC2010(5025)_M]
R_bal_S1  3K3  [RESC0603(1608)_N]
R_bal_S2  3K3  [RESC0603(1608)_N]
R_bal_S3  3K3  [RESC0603(1608)_N]
R_bal_S4  3K3  [RESC0603(1608)_N]
R_bal_S5  3K3  [RESC0603(1608)_N]
R_bal_S6  3K3  [RESC0603(1608)_N]
R_bal_S7  3K3  [RESC0603(1608)_N]
R_bal_S8  3K3  [RESC0603(1608)_N]
R_bal_S9  3K3  [RESC0603(1608)_N]
R_bal_S10  3K3  [RESC0603(1608)_N]
R_bal_S11  3K3  [RESC0603(1608)_N]
R_bal_S12  3K3  [RESC0603(1608)_N]
RR1  1K  [RESC0603(1608)_N]
RR2  1K  [RESC0603(1608)_N]
RR3  1K  [RESC0603(1608)_N]
RR4  1K  [RESC0603(1608)_N]
RR5  1K  [RESC0603(1608)_N]
RR6  1K  [RESC0603(1608)_N]
RR7  1K  [RESC0603(1608)_N]
RR8  1K  [RESC0603(1608)_N]
RR9  1K  [RESC0603(1608)_N]
RR10  1K  [RESC0603(1608)_N]
RR11  1K  [RESC0603(1608)_N]
RR12  1K  [RESC0603(1608)_N]

### Ports
C[0..12] (in), S[0..18] (in)

### Nets
C12: Q12.2(S)
C0: DD1.1(K) R1A.1 R1B.1
C1: DD2.1(K) Q1.2(S) R2A.1 R2B.1
C2: DD3.1(K) Q2.2(S) R3A.1 R3B.1
C3: DD4.1(K) Q3.2(S) R4A.1 R4B.1
C4: DD5.1(K) Q4.2(S) R5A.1 R5B.1
C5: DD6.1(K) Q5.2(S) R6A.1 R6B.1
C6: DD7.1(K) Q6.2(S) R7A.1 R7B.1
C7: DD8.1(K) Q7.2(S) R8A.1 R8B.1
C8: DD9.1(K) Q8.2(S) R9A.1 R9B.1
C9: DD10.1(K) Q9.2(S) R10A.1 R10B.1
C10: DD11.1(K) Q10.2(S) R11A.1 R11B.1
C11: DD12.1(K) Q11.2(S) R12A.1 R12B.1
S1: R_bal_S1.2
S2: R_bal_S2.2
S3: R_bal_S3.2
S4: R_bal_S4.2
S5: R_bal_S5.2
S6: R_bal_S6.2
S7: R_bal_S7.2
S8: R_bal_S8.2
S9: R_bal_S9.2
S10: R_bal_S10.2
S11: R_bal_S11.2
S12: R_bal_S12.2
NetDD1_2: DD1.2(A) RR1.2
NetDD2_2: DD2.2(A) RR2.2
NetDD3_2: DD3.2(A) RR3.2
NetDD4_2: DD4.2(A) RR4.2
NetDD5_2: DD5.2(A) RR5.2
NetDD6_2: DD6.2(A) RR6.2
NetDD7_2: DD7.2(A) RR7.2
NetDD8_2: DD8.2(A) RR8.2
NetDD9_2: DD9.2(A) RR9.2
NetDD10_2: DD10.2(A) RR10.2
NetDD11_2: DD11.2(A) RR11.2
NetDD12_2: DD12.2(A) RR12.2
NetQ1_1: Q1.1(G) R_bal_S1.1
NetQ1_3: Q1.3(D) R1A.2 R1B.2 RR1.1
NetQ2_1: Q2.1(G) R_bal_S2.1
NetQ2_3: Q2.3(D) R2A.2 R2B.2 RR2.1
NetQ3_1: Q3.1(G) R_bal_S3.1
NetQ3_3: Q3.3(D) R3A.2 R3B.2 RR3.1
NetQ4_1: Q4.1(G) R_bal_S4.1
NetQ4_3: Q4.3(D) R4A.2 R4B.2 RR4.1
NetQ5_1: Q5.1(G) R_bal_S5.1
NetQ5_3: Q5.3(D) R5A.2 R5B.2 RR5.1
NetQ6_1: Q6.1(G) R_bal_S6.1
NetQ6_3: Q6.3(D) R6A.2 R6B.2 RR6.1
NetQ7_1: Q7.1(G) R_bal_S7.1
NetQ7_3: Q7.3(D) R7A.2 R7B.2 RR7.1
NetQ8_1: Q8.1(G) R_bal_S8.1
NetQ8_3: Q8.3(D) R8A.2 R8B.2 RR8.1
NetQ9_1: Q9.1(G) R_bal_S9.1
NetQ9_3: Q9.3(D) R9A.2 R9B.2 RR9.1
NetQ10_1: Q10.1(G) R_bal_S10.1
NetQ10_3: Q10.3(D) R10A.2 R10B.2 RR10.1
NetQ11_1: Q11.1(G) R_bal_S11.1
NetQ11_3: Q11.3(D) R11A.2 R11B.2 RR11.1
NetQ12_1: Q12.1(G) R_bal_S12.1
NetQ12_3: Q12.3(D) R12A.2 R12B.2 RR12.1

### Buses and harness runs
bus C[0..12] = port C[0..12]
bus S[0..12] = port S[0..18]

### Notes on the sheet
- - resistors are placeholders
  - pick 62R high-precision model
- Fraunhofer IISB
- Schottkystr. 10
- developed by:
- 91058 Erlangen
- Germany
- Author
- Project
- License
- Description
- File
- Version
- Release Date
- Sheet
- www.foxbms.org
- www.iisb.fraunhofer.de
- foxBMS Team
- /

### Library data of the parts
DD1-DD12 = 150060SS75000: WL-SMCW SMT Mono-color Chip LED Waterclear, size 0603, Super Red, 1.9V, 140deg; Chip Technology: AlInGaP; Dominant Wavelength typ.: 630nm; Luminous Intensity typ.: 60mcd; Peak Wavelength typ.: 645nm; Viewing Angle: 140deg; ComponentLink1Description: Manufacturer; ComponentLink1URL: http://www.we-online.de; ComponentLink2URL: https://www.we-online.com/catalog/datasheet/150060SS75000.pdf; ComponentLink2Description: Datasheet; Forward Voltage typ.: 1.9V; Emitting Color: Super Red; Mounting Technology: SMT; Operating Temperature: -40 to +85degC; Published Date: December 2019; Part Number: 150060SS75000; Packaging: Tape and Reel; Size: 0603; Publisher: Wurth Elektronik
Q1-Q12 = CMP-2100-03638-2: MOSFET P-CH 20V 2A SSOT3; Fall Time: 11ns; Rise Time: 9ns; Voltage Rating (DC): -20V; Power Dissipation: 500mW; Nominal Vgs: -800mV; Current Rating: -2A; Gate to Source Voltage (Vgs): 8V; Rds On Max: 70mR; Turn-Off Delay Time: 27ns; Element Configuration: Single; Number of Elements: 1; Input Capacitance: 779pF; Drain to Source Resistance: 60mR; Turn-On Delay Time: 10ns; Package Quantity: 1; Mount: Surface Mount; Case/Package: SOT-23; Min Operating Temperature: -55°C; REACH SVHC: No SVHC; Weight: 0.03g; Packaging: Tape and Reel; Threshold Voltage: -800mV; Max Operating Temperature: 150°C; Dual Supply Voltage: -20V; Termination: SMD/SMT; Drain to Source Voltage (Vdss): 20V; Height: 0.94mm; Length: 2.92mm; Contact Plating: Tin; Width: 3.05mm; Drain to Source Breakdown Voltage: -20V; Max Power Dissipation: 500mW; Continuous Drain Current (ID): 2A; Number of Pins: 3; Lead Free: Lead Free; Radiation Hardening: No; On-State Resistance: 70MR
R1A R1B R2A R2B R3A R3B R4A R4B R5A R5B R6A R6B R7A R7B R8A R8B R9A R9B R10A R10B R11A R11B R12A R12B = CMP-1017-00374-1: 61R9 0.75W 1% 2010 (5025 Metric)  SMD; Case-Metric: 5025; Case-EIA: 2010; Value: 61.90 Ohm; Power: 0.75 W; Tolerance: 1 %; Technology: SMT
R_bal_S1-R_bal_S12 = Res 3K3: Chipwiderstand, SMD, Baureihe MC, 1%; Manufacturer: Multicomp; Power: 100mW; PackageReference: 0603; Value: 3K3; OC_FARNELL: 9331026
RR1-RR12 = Res 1K: Chipwiderstand, SMD, Baureihe MC, 1%; Manufacturer: Multicomp; Power: 100mW; PackageReference: 0603; Value: 1K; OC_FARNELL: 9330380

## Sheet decoupling.SchDoc: foxBMS BMS-Slave 12-Cell
size A3; DocumentNumber: 12; SheetNumber: 12; SheetTotal: 21; AUTHOR: Fraunhofer IISB foxBMS Team; SheetDescription: Primary Voltage Measurement
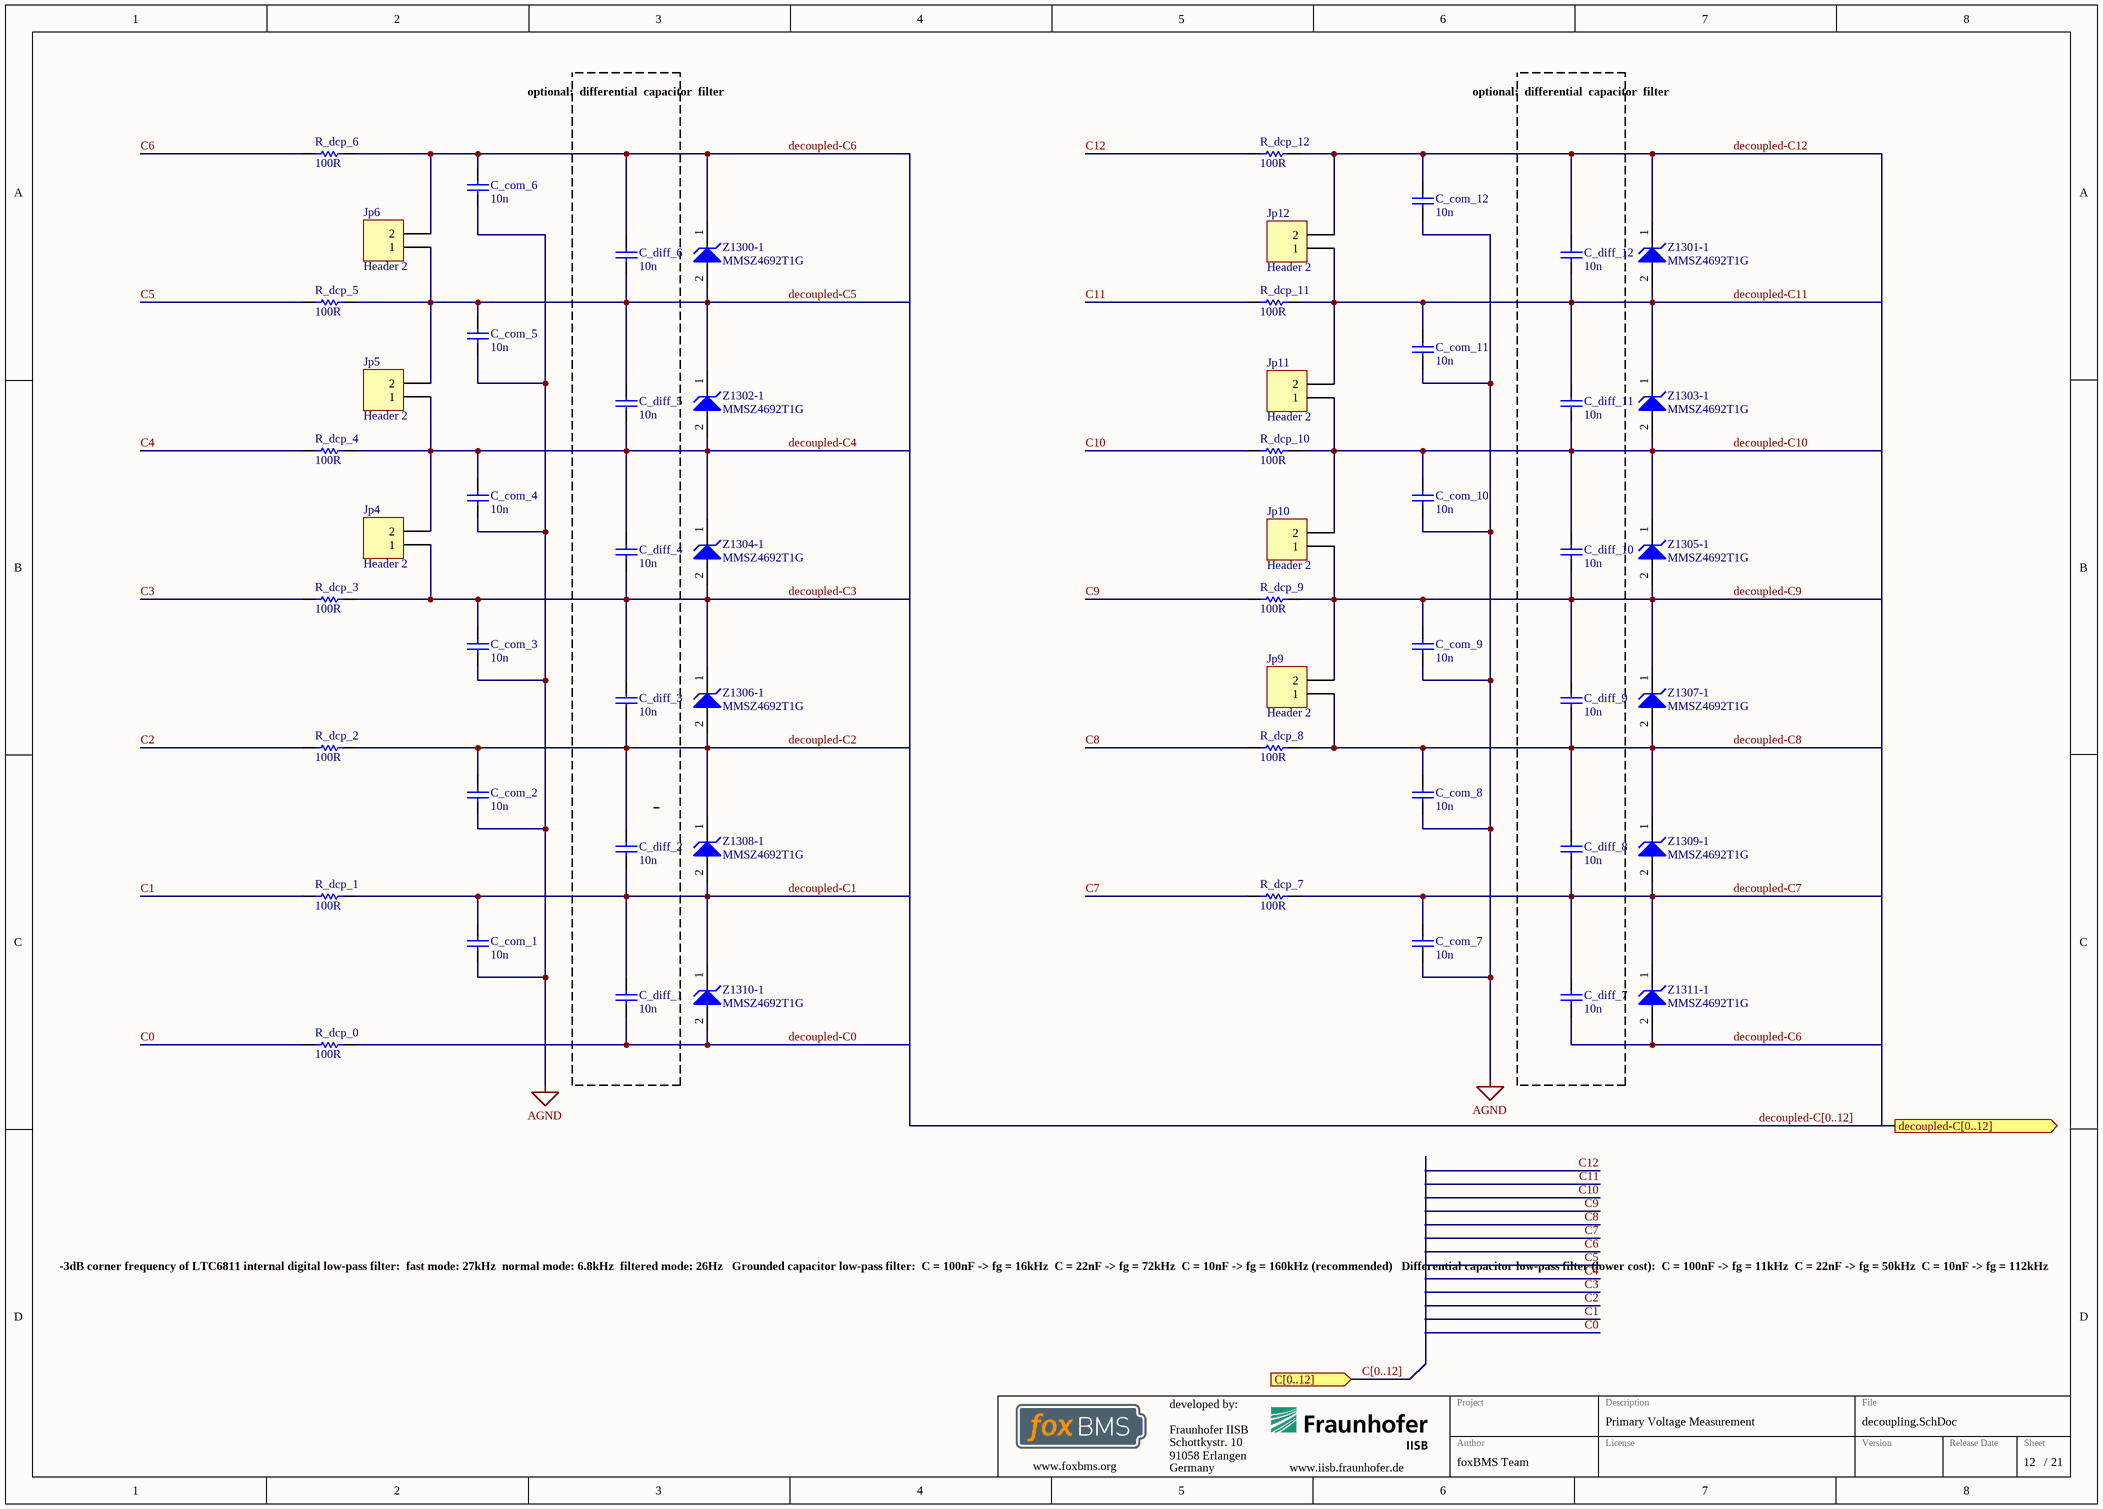
[diagram p8: decoupling.SchDoc]

### Parts
C_com_1  10n  [CAPC0603(1608)55_N]
C_com_2  10n  [CAPC0603(1608)55_N]
C_com_3  10n  [CAPC0603(1608)55_N]
C_com_4  10n  [CAPC0603(1608)55_N]
C_com_5  10n  [CAPC0603(1608)55_N]
C_com_6  10n  [CAPC0603(1608)55_N]
C_com_7  10n  [CAPC0603(1608)55_N]
C_com_8  10n  [CAPC0603(1608)55_N]
C_com_9  10n  [CAPC0603(1608)55_N]
C_com_10  10n  [CAPC0603(1608)55_N]
C_com_11  10n  [CAPC0603(1608)55_N]
C_com_12  10n  [CAPC0603(1608)55_N]
C_diff_1  10n  [CAPC0603(1608)55_N]
C_diff_2  10n  [CAPC0603(1608)55_N]
C_diff_3  10n  [CAPC0603(1608)55_N]
C_diff_4  10n  [CAPC0603(1608)55_N]
C_diff_5  10n  [CAPC0603(1608)55_N]
C_diff_6  10n  [CAPC0603(1608)55_N]
C_diff_7  10n  [CAPC0603(1608)55_N]
C_diff_8  10n  [CAPC0603(1608)55_N]
C_diff_9  10n  [CAPC0603(1608)55_N]
C_diff_10  10n  [CAPC0603(1608)55_N]
C_diff_11  10n  [CAPC0603(1608)55_N]
C_diff_12  10n  [CAPC0603(1608)55_N]
Jp4  Header 2  [HDR1X2]
Jp5  Header 2  [HDR1X2]
Jp6  Header 2  [HDR1X2]
Jp9  Header 2  [HDR1X2]
Jp10  Header 2  [HDR1X2]
Jp11  Header 2  [HDR1X2]
Jp12  Header 2  [HDR1X2]
R_dcp_0  100R  [RESC0603(1608)_N]
R_dcp_1  100R  [RESC0603(1608)_N]
R_dcp_2  100R  [RESC0603(1608)_N]
R_dcp_3  100R  [RESC0603(1608)_N]
R_dcp_4  100R  [RESC0603(1608)_N]
R_dcp_5  100R  [RESC0603(1608)_N]
R_dcp_6  100R  [RESC0603(1608)_N]
R_dcp_7  100R  [RESC0603(1608)_N]
R_dcp_8  100R  [RESC0603(1608)_N]
R_dcp_9  100R  [RESC0603(1608)_N]
R_dcp_10  100R  [RESC0603(1608)_N]
R_dcp_11  100R  [RESC0603(1608)_N]
R_dcp_12  100R  [RESC0603(1608)_N]
Z1300-1  MMSZ4692T1G  [ONSC-SOD-123-2-425-04_V]
Z1301-1  MMSZ4692T1G  [ONSC-SOD-123-2-425-04_V]
Z1302-1  MMSZ4692T1G  [ONSC-SOD-123-2-425-04_V]
Z1303-1  MMSZ4692T1G  [ONSC-SOD-123-2-425-04_V]
Z1304-1  MMSZ4692T1G  [ONSC-SOD-123-2-425-04_V]
Z1305-1  MMSZ4692T1G  [ONSC-SOD-123-2-425-04_V]
Z1306-1  MMSZ4692T1G  [ONSC-SOD-123-2-425-04_V]
Z1307-1  MMSZ4692T1G  [ONSC-SOD-123-2-425-04_V]
Z1308-1  MMSZ4692T1G  [ONSC-SOD-123-2-425-04_V]
Z1309-1  MMSZ4692T1G  [ONSC-SOD-123-2-425-04_V]
Z1310-1  MMSZ4692T1G  [ONSC-SOD-123-2-425-04_V]
Z1311-1  MMSZ4692T1G  [ONSC-SOD-123-2-425-04_V]

### Blocks framed on the sheet
optional: / differential / capacitor / filter: C_diff_1-C_diff_6
optional: / differential / capacitor / filter: C_diff_7-C_diff_12

### Ports
C[0..12] (in), decoupled-C[0..12] (out)

### Nets
AGND: C_com_1.1 C_com_2.1 C_com_3.1 C_com_4.1 C_com_5.2 C_com_6.2 C_com_7.1 C_com_8.1 C_com_9.1 C_com_10.1 C_com_11.1 C_com_12.1
C12: R_dcp_12.1
C0: R_dcp_0.1
C1: R_dcp_1.1
C2: R_dcp_2.1
C3: R_dcp_3.1
C4: R_dcp_4.1
C5: R_dcp_5.1
C6: R_dcp_6.1
C7: R_dcp_7.1
C8: R_dcp_8.1
C9: R_dcp_9.1
C10: R_dcp_10.1
C11: R_dcp_11.1
decoupled-C0: C_diff_1.1 R_dcp_0.2 Z1310-1.2(A)
decoupled-C1: C_com_1.2 C_diff_1.2 C_diff_2.1 R_dcp_1.2 Z1308-1.2(A) Z1310-1.1(K)
decoupled-C2: C_com_2.2 C_diff_2.2 C_diff_3.1 R_dcp_2.2 Z1306-1.2(A) Z1308-1.1(K)
decoupled-C3: C_com_3.2 C_diff_3.2 C_diff_4.1 Jp4.1 R_dcp_3.2 Z1304-1.2(A) Z1306-1.1(K)
decoupled-C4: C_com_4.2 C_diff_4.2 C_diff_5.1 Jp4.2 Jp5.1 R_dcp_4.2 Z1302-1.2(A) Z1304-1.1(K)
decoupled-C5: C_com_5.1 C_diff_5.2 C_diff_6.1 Jp5.2 Jp6.1 R_dcp_5.2 Z1300-1.2(A) Z1302-1.1(K)
decoupled-C6: C_com_6.1 C_diff_6.2 C_diff_7.1 Jp6.2 R_dcp_6.2 Z1300-1.1(K) Z1311-1.2(A)
decoupled-C7: C_com_7.2 C_diff_7.2 C_diff_8.1 R_dcp_7.2 Z1309-1.2(A) Z1311-1.1(K)
decoupled-C8: C_com_8.2 C_diff_8.2 C_diff_9.1 Jp9.1 R_dcp_8.2 Z1307-1.2(A) Z1309-1.1(K)
decoupled-C9: C_com_9.2 C_diff_9.2 C_diff_10.1 Jp9.2 Jp10.1 R_dcp_9.2 Z1305-1.2(A) Z1307-1.1(K)
decoupled-C10: C_com_10.2 C_diff_10.2 C_diff_11.1 Jp10.2 Jp11.1 R_dcp_10.2 Z1303-1.2(A) Z1305-1.1(K)
decoupled-C11: C_com_11.2 C_diff_11.2 C_diff_12.1 Jp11.2 Jp12.1 R_dcp_11.2 Z1301-1.2(A) Z1303-1.1(K)
decoupled-C12: C_com_12.2 C_diff_12.2 Jp12.2 R_dcp_12.2 Z1301-1.1(K)

### Buses and harness runs
bus C[0..12] = port C[0..12]
bus decoupled-C[0..12] = port decoupled-C[0..12]

### Notes on the sheet
- -3dB corner frequency of LTC6811 internal digital low-pass filter:
  fast mode: 27kHz
  normal mode: 6.8kHz
  filtered mode: 26Hz
  Grounded capacitor low-pass filter:
  C = 100nF -> fg = 16kHz
  C = 22nF -> fg = 72kHz
  C = 10nF -> fg = 160kHz (recommended)
  Differential capacitor low-pass filter (lower cost):
  C = 100nF -> fg = 11kHz
  C = 22nF -> fg = 50kHz
  C = 10nF -> fg = 112kHz
- Fraunhofer IISB
- Schottkystr. 10
- developed by:
- 91058 Erlangen
- Germany
- Author
- Project
- License
- Description
- File
- Version
- Release Date
- Sheet
- www.foxbms.org
- www.iisb.fraunhofer.de
- foxBMS Team
- /

### Library data of the parts
C_com_1-C_com_12 C_diff_1-C_diff_12 = Cap 10n: as C3 on sheet CAN_Transceiver_3V3; OC_MOUSER: CGA3E2X7R1H103K080AA; Value: 10n; PackageReference: 0603; Tolerance: ± 10%
Jp4-Jp6 Jp9-Jp12 = Header 2: Header, 2-Pin; LatestRevisionDate: 17-Jul-2002; LatestRevisionNote: Re-released for DXP Platform.; Publisher: Altium Limited
R_dcp_0-R_dcp_12 = Res 100R: as R4 on sheet LTC_6811-1; PackageReference: 0603; Value: 100R; OC_FARNELL: 2447227
Z1300-1 Z1301-1 Z1302-1 Z1303-1 Z1304-1 Z1305-1 Z1306-1 Z1307-1 Z1308-1 Z1309-1 Z1310-1 Z1311-1 = CMP-1060-00434-1: Zener Voltage Regulator, 500 mW, 2-Pin SOD-123, Pb-Free, Tape and Reel; Manufacturer: On Semiconductor; VZ Typ (V): 6.8; P Max (W): 0.5; ComponentLink2URL: http://www.onsemi.com/pub_link/Collateral/MMSZ4678T1-D.PDF; Mounting Technology: Surface Mount; DatasheetVersion: Rev. 9; ComponentLink1Description: Manufacturer URL; ComponentLink3URL: http://www.onsemi.com/pub_link/Collateral/425-04.PDF; PackageReference: SOD-123-2-425-04; ComponentLink2Description: Datasheet; RoHS: Pb-Free; Packing: Tape and Reel; ComponentLink1URL: http://www.onsemi.com/; PackageDescription: 2-Pin SOD, Body 1.6 x 2.69 mm; ComponentLink3Description: Package Specification; PartNumber: MMSZ4692T1G; PackageVersion: Rev. G, 10/2009

## Sheet subtractor_single.SchDoc
size A
Used 12 times, as channels S4/TEMP1, S4/TEMP2, S4/TEMP3, S4/TEMP4, S4/TEMP5, S4/TEMP6, S4/TEMP7, S4/TEMP8, S4/TEMP9, S4/TEMP10, S4/TEMP11, S4/TEMP12. Parts and nets are listed once, with the designators drawn on the sheet.
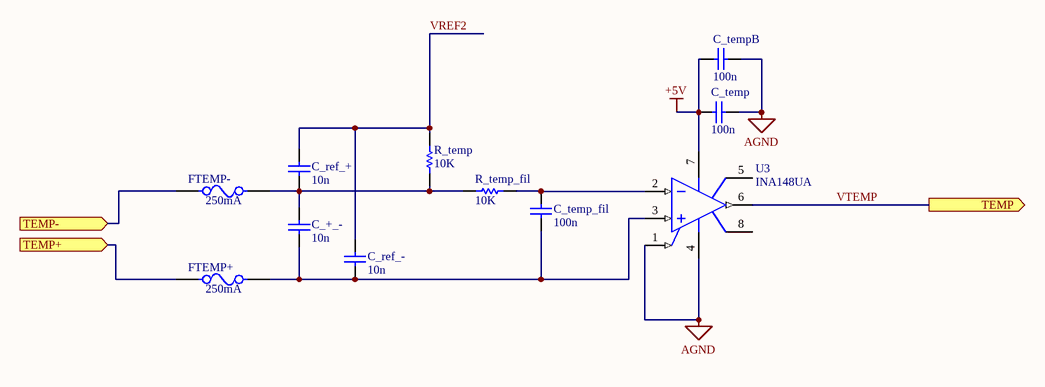
[diagram p9: subtractor_single.SchDoc]

### Parts
C_+_-  10n  [CAPC0603(1608)55_N]
C_ref_+  10n  [CAPC0603(1608)55_N]
C_ref_-  10n  [CAPC0603(1608)55_N]
C_temp  100n  [CAPC0603(1608)55_N]
C_temp_fil  100n  [CAPC0603(1608)55_N]
C_tempB  100n  [CAPC0603(1608)55_N]
FTEMP+  250mA  [RESC0603(1608)_N]
FTEMP-  250mA  [RESC0603(1608)_N]
R_temp  10K  [RESC0603(1608)_N]
R_temp_fil  10K  [RESC0603(1608)_N]
U3  INA148UA  [D0008A_N]

### Ports
TEMP (out), TEMP+ (in), TEMP- (in)

### Nets
+5V: C_temp.1 C_tempB.1 U3.7(V+)
AGND: C_temp.2 C_tempB.2 U3.1(REF) U3.4(V-)
TEMP+: FTEMP+.1 ; port TEMP+
TEMP-: FTEMP-.1 ; port TEMP-
VREF2: C_ref_+.2 C_ref_-.2 R_temp.2
VTEMP: U3.6(OUT) ; port TEMP
NetC_+_-_1: C_+_-.1 C_ref_-.1 C_temp_fil.1 FTEMP+.2 U3.3(IN+)
NetC_+_-_2: C_+_-.2 C_ref_+.1 FTEMP-.2 R_temp.1 R_temp_fil.2
NetC_temp_fil_2: C_temp_fil.2 R_temp_fil.1 U3.2(IN-)

Not connected (* = marked no-connect by the designer): U3 5(NC) 8(NC)

### Channels
S4/TEMP1: designators end in _1; ports TEMP+=TEMP+1 TEMP-=TEMP-1 TEMP=TEMP1
S4/TEMP2: designators end in _2; ports TEMP+=TEMP+2 TEMP-=TEMP-2 TEMP=TEMP2
S4/TEMP3: designators end in _3; ports TEMP+=TEMP+3 TEMP-=TEMP-3 TEMP=TEMP3
S4/TEMP4: designators end in _4; ports TEMP+=TEMP+4 TEMP-=TEMP-4 TEMP=TEMP4
S4/TEMP5: designators end in _5; ports TEMP+=TEMP+5 TEMP-=TEMP-5 TEMP=TEMP5
S4/TEMP6: designators end in _6; ports TEMP+=TEMP+6 TEMP-=TEMP-6 TEMP=TEMP6
S4/TEMP7: designators end in _7; ports TEMP+=TEMP+7 TEMP-=TEMP-7 TEMP=TEMP7
S4/TEMP8: designators end in _8; ports TEMP+=TEMP+8 TEMP-=TEMP-8 TEMP=TEMP8
S4/TEMP9: designators end in _9; ports TEMP+=TEMP+9 TEMP-=TEMP-9 TEMP=TEMP9
S4/TEMP10: designators end in _10; ports TEMP+=TEMP+10 TEMP-=TEMP-10 TEMP=TEMP10
S4/TEMP11: designators end in _11; ports TEMP+=TEMP+11 TEMP-=TEMP-11 TEMP=TEMP11
S4/TEMP12: designators end in _12; ports TEMP+=TEMP+12 TEMP-=TEMP-12 TEMP=TEMP12

### Library data of the parts
C_+_- C_ref_+ C_ref_- = Cap 10n: as C3 on sheet CAN_Transceiver_3V3; OC_MOUSER: CGA3E2X7R1H103K080AA; Value: 10n; PackageReference: 0603; Tolerance: ± 10%
C_temp C_temp_fil C_tempB = Cap 100n: as C_temp1 on sheet MCU; OC_MOUSER: CGA3E2X7R1H104K080AA; Value: 100n; PackageReference: 0603; Tolerance: ± 10%
FTEMP+ FTEMP- = Bel Fuse C2Q250: as F4 on sheet Input_Fuses; OC_Mouser: 530-C2Q250; Value: 250mA; PackageReference: 0603; Manufacturer: Bel Fuse; Characteristic: Fast Blow
R_temp R_temp_fil = Res 10K: as R8 on sheet Mux; PackageReference: 0603; Value: 10K; OC_FARNELL: 9330399
U3 = CMP-0985-00055-2: +/- 200 V Common-Mode Voltage Difference Amplifier, -40 to 85 degC, 8-pin SOIC (D8), Green (RoHS & no Sb/Br); Manufacturer: Texas Instruments; Vs(Min)(V): 2.7; Slew Rate(Typ)(V/us): 1; CMRR(Min)(dB): 70; Input Offset (+/-)(Max)(uV): 5000; Vs(Max)(V): 36; DatasheetVersion: SBOS123; ComponentLink3Description: Package Specification; Gain(V/V): 1; PackageReference: D0008A; SubFamily: Difference Amplifier; PackageVersion: 4040047-3/M, 06/2011; Mounting Technology: Surface Mount; ComponentLink1Description: Manufacturer URL; Eco-Plan: Green (RoHS & no Sb/Br); Number of Channels: 1; ComponentLink1URL: http://www.ti.com/; ComponentLink2URL: http://www.ti.com/general/docs/lit/getliterature.tsp?genericPartNumber=INA148&fileType=pdf; PartNumber: INA148UA; ComponentLink3URL: http://www.ti.com/litv/pdf/msoi002j; ComponentLink2Description: Datasheet; PackageDescription: 8-Pin Plastic Small Outline, Body 4.9 x 3.9 mm, Pitch 1.27 mm; Code_JEDEC: MS-012

## Sheet Connector.SchDoc
size 199 x 139 mm; DocumentNumber: 3; SheetNumber: 3; SheetTotal: 11
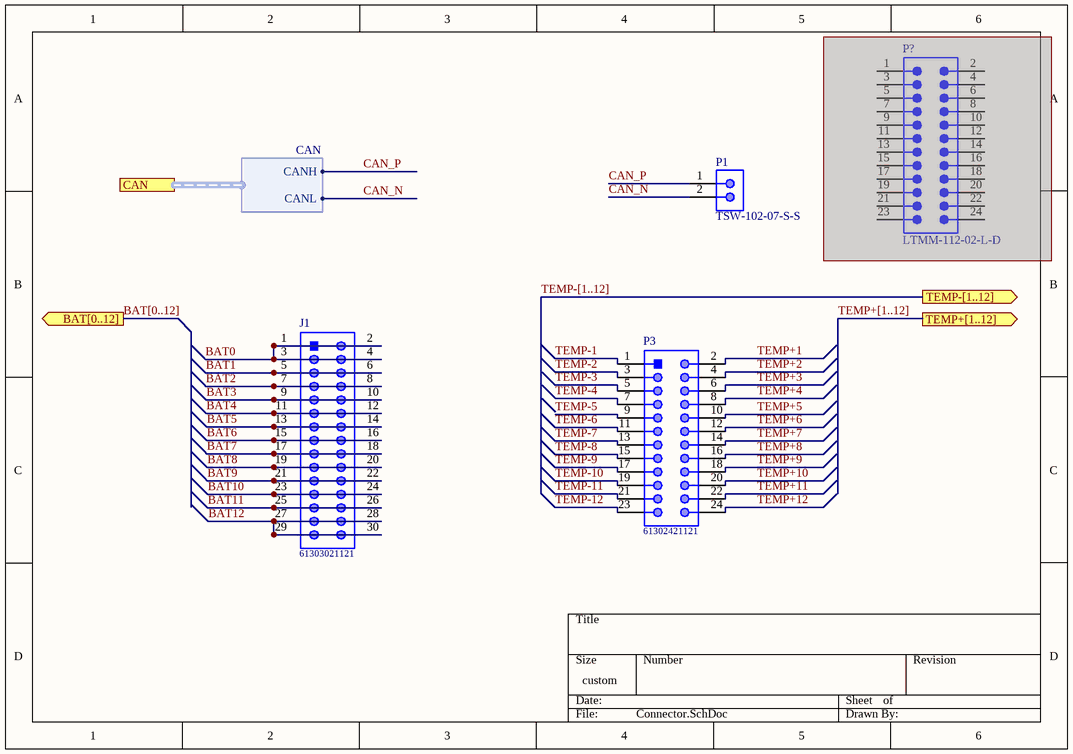
[diagram p10: Connector.SchDoc]

### Parts
J1  61303021121  [61303021121]
P1  TSW-102-07-S-S  [SMTC-TSW-102-07-S-S]
P3  61302421121  [61302421121]
P?  LTMM-112-02-L-D  [SMTC-LTMM-112-02-X-D]  (masked out: inside a compile mask, not in the netlist)

### Ports
BAT[0..12] (out), CAN (harness CAN), TEMP+[1..12] (out), TEMP-[1..12] (out)

### Harnesses
CAN: CANH, CANL

### Nets
BAT0: J1.1 J1.2 J1.3 J1.4
BAT1: J1.5 J1.6
BAT2: J1.7 J1.8
BAT3: J1.9 J1.10
BAT4: J1.11 J1.12
BAT5: J1.13 J1.14
BAT6: J1.15 J1.16
BAT7: J1.17 J1.18
BAT8: J1.19 J1.20
BAT9: J1.21 J1.22
BAT10: J1.23 J1.24
BAT11: J1.25 J1.26
BAT12: J1.27 J1.28 J1.29 J1.30
CAN_N: P1.2 ; port CAN.CANL
CAN_P: P1.1 ; port CAN.CANH
TEMP+1: P3.2
TEMP+2: P3.4
TEMP+3: P3.6
TEMP+4: P3.8
TEMP+5: P3.10
TEMP+6: P3.12
TEMP+7: P3.14
TEMP+8: P3.16
TEMP+9: P3.18
TEMP+10: P3.20
TEMP+11: P3.22
TEMP+12: P3.24
TEMP-1: P3.1
TEMP-2: P3.3
TEMP-3: P3.5
TEMP-4: P3.7
TEMP-5: P3.9
TEMP-6: P3.11
TEMP-7: P3.13
TEMP-8: P3.15
TEMP-9: P3.17
TEMP-10: P3.19
TEMP-11: P3.21
TEMP-12: P3.23

### Buses and harness runs
bus BAT[0..12] = port BAT[0..12]
bus TEMP+[1..12] = port TEMP+[1..12]
bus TEMP-[1..12] = port TEMP-[1..12]

### Library data of the parts
J1 = CMP-1502-01116-1: THT Vertical Pin Header WR-PHD, Pitch 2.54 mm, Dual Row, 30 pins; Manufacturer: Wurth Elektronik; Pin Number: 30; Rated Current: 3A; Working Voltage: 250VAC; Gender: Male; Withstanding Voltage: 500VAC; Contact Resistance: 20mOhm; Pitch: 2.54mm; Datasheet URL: https://katalog.we-online.de/em/datasheet/6130xx21121.pdf; Row Number: Dual; Package Reference: 61303021121; Mounting Technology: THT; Operating Temperature: -40to105degC; Manufacturer URL: http://www.we-online.de; Publisher: WurthElektronik; Packaging: Bag; Part Number: 61303021121; Orientation: Vertical
P1 = CMP-1681-00004-4: Male Header, Pitch 2.54 mm, 1 x 2 Position, Height 8.38 mm, Tail Length 2.54 mm, -55 to 125 degC, RoHS, Bulk; Manufacturer: Samtec; Rows: 1; ComponentLink1URL: http://www.samtec.com/; Contact Finish: Gold; Mounting Technology: Through Hole; PackageReference: TSW-102-07-S-S; RoHSCompliant: true; Pins: 2; Contact Material: Bronze; ComponentLink2Description: Datasheet; Max Operating Temperature: 125 degC; Min Operating Temperature: -55 degC; Height: 8.38 mm; Packaging: Bulk; ComponentLink1Description: Manufacturer URL; PackageDescription: Male Header, Pitch 2.54 mm, 1 x 2 Position, Height 8.38 mm, Tail Length 2.54 mm; Colour: Black; Contact Plating: Gold; Length: 5.08 mm; ComponentLink2URL: http://suddendocs.samtec.com/catalog_english/tsw_th.pdf; DatasheetVersion: 12/2015; Mount: Through Hole; Lead Pitch: 0.1 inch; REACH SVHC: No SVHC; Package Quantity: 1
P3 = CMP-1502-01111-1: THT Vertical Pin Header WR-PHD, Pitch 2.54 mm, Dual Row, 24 pins; Manufacturer: Wurth Elektronik; Contact Resistance: 20mOhm; Pitch: 2.54mm; Pin Number: 24; Withstanding Voltage: 500VAC; Rated Current: 3A; Gender: Male; Working Voltage: 250VAC; Publisher: WurthElektronik; Mounting Technology: THT; Orientation: Vertical; Part Number: 61302421121; Package Reference: 61302421121; Row Number: Dual; Manufacturer URL: http://www.we-online.de; Packaging: Bag; Operating Temperature: -40to105degC; Datasheet URL: https://katalog.we-online.de/em/datasheet/6130xx21121.pdf
P? = CMP-1028-00029-1: Shrouded Header & Stacker, Through-Hole, Vertical, -55 to 125 degC, 2 mm Pitch, 24-Pin, Male, RoHS; Manufacturer: Samtec; Pitch: 2 mm; PackageReference: LTMM-112-02-X-D; Orientation: Vertical; DatasheetVersion: F-214; PackageDescription: LTMM Assembly; ComponentLink1URL: http://www.samtec.com; ComponentLink1Description: Manufacturer URL; Mounting Technology: Through-hole; RoHS: True; ComponentLink2Description: Datasheet; ComponentLink3Description: Package Specification; ComponentLink2URL: http://d2a072wq521u33.cloudfront.net/catalog_english//LTMM.PDF; Temperature Range: -55 to 125 degC; PartNumber: LTMM-112-02-L-D; ComponentLink3URL: http://www.samtec.com/documents/webfiles/cpdf/LTMM-1XX-XX-XX-D-XX-XX-MKT.pdf; PackageVersion: AQ, 5/1992

## Nets that join several sheets
+3.3V: MCU (F1.2), CAN_Transceiver_3V3 (C1.1 C3.1 U1.3), LTC_6811-1 (R5.2)
+5V: MCU (C_temp1.1 F2.2), LTC_6811-1 (7 pins), Mux (7 pins), S4/TEMP1 (C_temp_1.1 C_tempB_1.1 U3_1.7), S4/TEMP2 (C_temp_2.1 C_tempB_2.1 U3_2.7), S4/TEMP3 (C_temp_3.1 C_tempB_3.1 U3_3.7), S4/TEMP4 (C_temp_4.1 C_tempB_4.1 U3_4.7), S4/TEMP5 (C_temp_5.1 C_tempB_5.1 U3_5.7), S4/TEMP6 (C_temp_6.1 C_tempB_6.1 U3_6.7), S4/TEMP7 (C_temp_7.1 C_tempB_7.1 U3_7.7), S4/TEMP8 (C_temp_8.1 C_tempB_8.1 U3_8.7), S4/TEMP9 (C_temp_9.1 C_tempB_9.1 U3_9.7), S4/TEMP10 (C_temp_10.1 C_tempB_10.1 U3_10.7), S4/TEMP11 (C_temp_11.1 C_tempB_11.1 U3_11.7), S4/TEMP12 (C_temp_12.1 C_tempB_12.1 U3_12.7)
AGND: MCU (C_temp1.2), Input_Fuses (FB1.1 R3.2), LTC_6811-1 (8 pins), Mux (8 pins), decoupling (12 pins), S4/TEMP1 (C_temp_1.2 C_tempB_1.2 U3_1.1 U3_1.4), S4/TEMP2 (C_temp_2.2 C_tempB_2.2 U3_2.1 U3_2.4), S4/TEMP3 (C_temp_3.2 C_tempB_3.2 U3_3.1 U3_3.4), S4/TEMP4 (C_temp_4.2 C_tempB_4.2 U3_4.1 U3_4.4), S4/TEMP5 (C_temp_5.2 C_tempB_5.2 U3_5.1 U3_5.4), S4/TEMP6 (C_temp_6.2 C_tempB_6.2 U3_6.1 U3_6.4), S4/TEMP7 (C_temp_7.2 C_tempB_7.2 U3_7.1 U3_7.4), S4/TEMP8 (C_temp_8.2 C_tempB_8.2 U3_8.1 U3_8.4), S4/TEMP9 (C_temp_9.2 C_tempB_9.2 U3_9.1 U3_9.4), S4/TEMP10 (C_temp_10.2 C_tempB_10.2 U3_10.1 U3_10.4), S4/TEMP11 (C_temp_11.2 C_tempB_11.2 U3_11.1 U3_11.4), S4/TEMP12 (C_temp_12.2 C_tempB_12.2 U3_12.1 U3_12.4)
C12: Input_Fuses (F3.1), LTC_6811-1 (R4.1), passive_balancing (Q12.2), decoupling (R_dcp_12.1)
GND: MCU (CN2.11), CAN_Transceiver_3V3 (6 pins), Input_Fuses (R3.1), LTC_6811-1 (C10.2 C11.2 D3.1 K1.4)
BAT0: Input_Fuses (F15.2), Connector (J1.1 J1.2 J1.3 J1.4)
BAT1: Input_Fuses (F14.1), Connector (J1.5 J1.6)
BAT2: Input_Fuses (F13.1), Connector (J1.7 J1.8)
BAT3: Input_Fuses (F12.1), Connector (J1.9 J1.10)
BAT4: Input_Fuses (F11.1), Connector (J1.11 J1.12)
BAT5: Input_Fuses (F10.1), Connector (J1.13 J1.14)
BAT6: Input_Fuses (F9.1), Connector (J1.15 J1.16)
BAT7: Input_Fuses (F8.1), Connector (J1.17 J1.18)
BAT8: Input_Fuses (F7.1), Connector (J1.19 J1.20)
BAT9: Input_Fuses (F6.1), Connector (J1.21 J1.22)
BAT10: Input_Fuses (F5.1), Connector (J1.23 J1.24)
BAT11: Input_Fuses (F4.1), Connector (J1.25 J1.26)
BAT12: Input_Fuses (F3.2), Connector (J1.27 J1.28 J1.29 J1.30)
C0: Input_Fuses (D1.1 F15.1 FB1.2), passive_balancing (DD1.1 R1A.1 R1B.1), decoupling (R_dcp_0.1)
C1: Input_Fuses (D1.2 F14.2), passive_balancing (DD2.1 Q1.2 R2A.1 R2B.1), decoupling (R_dcp_1.1)
C2: Input_Fuses (F13.2), passive_balancing (DD3.1 Q2.2 R3A.1 R3B.1), decoupling (R_dcp_2.1)
C3: Input_Fuses (F12.2), passive_balancing (DD4.1 Q3.2 R4A.1 R4B.1), decoupling (R_dcp_3.1)
C4: Input_Fuses (F11.2), passive_balancing (DD5.1 Q4.2 R5A.1 R5B.1), decoupling (R_dcp_4.1)
C5: Input_Fuses (F10.2), passive_balancing (DD6.1 Q5.2 R6A.1 R6B.1), decoupling (R_dcp_5.1)
C6: Input_Fuses (F9.2), passive_balancing (DD7.1 Q6.2 R7A.1 R7B.1), decoupling (R_dcp_6.1)
C7: Input_Fuses (F8.2), passive_balancing (DD8.1 Q7.2 R8A.1 R8B.1), decoupling (R_dcp_7.1)
C8: Input_Fuses (F7.2), passive_balancing (DD9.1 Q8.2 R9A.1 R9B.1), decoupling (R_dcp_8.1)
C9: Input_Fuses (F6.2), passive_balancing (DD10.1 Q9.2 R10A.1 R10B.1), decoupling (R_dcp_9.1)
C10: Input_Fuses (F5.2), passive_balancing (DD11.1 Q10.2 R11A.1 R11B.1), decoupling (R_dcp_10.1)
C11: Input_Fuses (F4.2), passive_balancing (DD12.1 Q11.2 R12A.1 R12B.1), decoupling (R_dcp_11.1)
CAN1_RX: MCU (CN4.25), CAN_Transceiver_3V3 (U1.4)
CAN1_TX: MCU (CN4.27), CAN_Transceiver_3V3 (U1.1)
CAN_N: CAN_Transceiver_3V3 (L1.5 R2.2), Connector (P1.2)
CAN_P: CAN_Transceiver_3V3 (L1.4 R1.2), Connector (P1.1)
CS: MCU (CN1.9), LTC_6811-1 (IC1.41)
decoupled-C0: LTC_6811-1 (IC1.26), decoupling (C_diff_1.1 R_dcp_0.2 Z1310-1.2)
decoupled-C1: LTC_6811-1 (IC1.24), decoupling (6 pins)
decoupled-C2: LTC_6811-1 (IC1.22), decoupling (6 pins)
decoupled-C3: LTC_6811-1 (IC1.20), decoupling (7 pins)
decoupled-C4: LTC_6811-1 (IC1.18), decoupling (8 pins)
decoupled-C5: LTC_6811-1 (IC1.16), decoupling (8 pins)
decoupled-C6: LTC_6811-1 (IC1.14), decoupling (7 pins)
decoupled-C7: LTC_6811-1 (IC1.12), decoupling (6 pins)
decoupled-C8: LTC_6811-1 (IC1.10), decoupling (7 pins)
decoupled-C9: LTC_6811-1 (IC1.8), decoupling (8 pins)
decoupled-C10: LTC_6811-1 (IC1.6), decoupling (8 pins)
decoupled-C11: LTC_6811-1 (IC1.4), decoupling (8 pins)
decoupled-C12: LTC_6811-1 (IC1.2), decoupling (5 pins)
LTC_GPIO1: LTC_6811-1 (IC1.27), Mux (U2.28)
LTC_GPIO2: LTC_6811-1 (IC1.28), Mux (U2.2)
LTC_GPIO3: LTC_6811-1 (IC1.29), Mux (R8.1 U2.17)
LTC_GPIO4: LTC_6811-1 (IC1.32), Mux (R9.1 U2.16)
LTC_GPIO5: LTC_6811-1 (IC1.33), Mux (R10.1 U2.15)
MISO: MCU (CN1.12), LTC_6811-1 (IC1.44 R5.1)
MOSI: MCU (CN1.13), LTC_6811-1 (IC1.43)
S1: LTC_6811-1 (IC1.25), passive_balancing (R_bal_S1.2)
S2: LTC_6811-1 (IC1.23), passive_balancing (R_bal_S2.2)
S3: LTC_6811-1 (IC1.21), passive_balancing (R_bal_S3.2)
S4: LTC_6811-1 (IC1.19), passive_balancing (R_bal_S4.2)
S5: LTC_6811-1 (IC1.17), passive_balancing (R_bal_S5.2)
S6: LTC_6811-1 (IC1.15), passive_balancing (R_bal_S6.2)
S7: LTC_6811-1 (IC1.13), passive_balancing (R_bal_S7.2)
S8: LTC_6811-1 (IC1.11), passive_balancing (R_bal_S8.2)
S9: LTC_6811-1 (IC1.9), passive_balancing (R_bal_S9.2)
S10: LTC_6811-1 (IC1.7), passive_balancing (R_bal_S10.2)
S11: LTC_6811-1 (IC1.5), passive_balancing (R_bal_S11.2)
S12: LTC_6811-1 (IC1.3), passive_balancing (R_bal_S12.2)
SCK: MCU (CN1.10), LTC_6811-1 (IC1.42)
TEMP1: Mux (U2.19), S4/TEMP1 (U3_1.6)
TEMP2: Mux (U2.20), S4/TEMP2 (U3_2.6)
TEMP3: Mux (U2.21), S4/TEMP3 (U3_3.6)
TEMP4: Mux (U2.22), S4/TEMP4 (U3_4.6)
TEMP5: Mux (U2.23), S4/TEMP5 (U3_5.6)
TEMP6: Mux (U2.24), S4/TEMP6 (U3_6.6)
TEMP7: Mux (U2.11), S4/TEMP7 (U3_7.6)
TEMP8: Mux (U2.10), S4/TEMP8 (U3_8.6)
TEMP9: Mux (U2.9), S4/TEMP9 (U3_9.6)
TEMP10: Mux (U2.8), S4/TEMP10 (U3_10.6)
TEMP11: Mux (U2.7), S4/TEMP11 (U3_11.6)
TEMP12: Mux (U2.6), S4/TEMP12 (U3_12.6)
TEMP+1: S4/TEMP1 (FTEMP+_1.1), Connector (P3.2)
TEMP+2: S4/TEMP2 (FTEMP+_2.1), Connector (P3.4)
TEMP+3: S4/TEMP3 (FTEMP+_3.1), Connector (P3.6)
TEMP+4: S4/TEMP4 (FTEMP+_4.1), Connector (P3.8)
TEMP+5: S4/TEMP5 (FTEMP+_5.1), Connector (P3.10)
TEMP+6: S4/TEMP6 (FTEMP+_6.1), Connector (P3.12)
TEMP+7: S4/TEMP7 (FTEMP+_7.1), Connector (P3.14)
TEMP+8: S4/TEMP8 (FTEMP+_8.1), Connector (P3.16)
TEMP+9: S4/TEMP9 (FTEMP+_9.1), Connector (P3.18)
TEMP+10: S4/TEMP10 (FTEMP+_10.1), Connector (P3.20)
TEMP+11: S4/TEMP11 (FTEMP+_11.1), Connector (P3.22)
TEMP+12: S4/TEMP12 (FTEMP+_12.1), Connector (P3.24)
TEMP-1: S4/TEMP1 (FTEMP-_1.1), Connector (P3.1)
TEMP-2: S4/TEMP2 (FTEMP-_2.1), Connector (P3.3)
TEMP-3: S4/TEMP3 (FTEMP-_3.1), Connector (P3.5)
TEMP-4: S4/TEMP4 (FTEMP-_4.1), Connector (P3.7)
TEMP-5: S4/TEMP5 (FTEMP-_5.1), Connector (P3.9)
TEMP-6: S4/TEMP6 (FTEMP-_6.1), Connector (P3.11)
TEMP-7: S4/TEMP7 (FTEMP-_7.1), Connector (P3.13)
TEMP-8: S4/TEMP8 (FTEMP-_8.1), Connector (P3.15)
TEMP-9: S4/TEMP9 (FTEMP-_9.1), Connector (P3.17)
TEMP-10: S4/TEMP10 (FTEMP-_10.1), Connector (P3.19)
TEMP-11: S4/TEMP11 (FTEMP-_11.1), Connector (P3.21)
TEMP-12: S4/TEMP12 (FTEMP-_12.1), Connector (P3.23)